# EAGLE design snd (EAGLE 5.11)
DRAWN_BY: Alexios; PROJECT_NAME: CFT Mini-Computer; REVISION: Rev A; SHEET_DESCRIPTION: Audio Device 1 of 2 (Bus Interface & SpeakJet); SIMULATION_FILENAME: N/A; URL: http://www.bedroomlan.org/cft

## Sheet 1 of 4
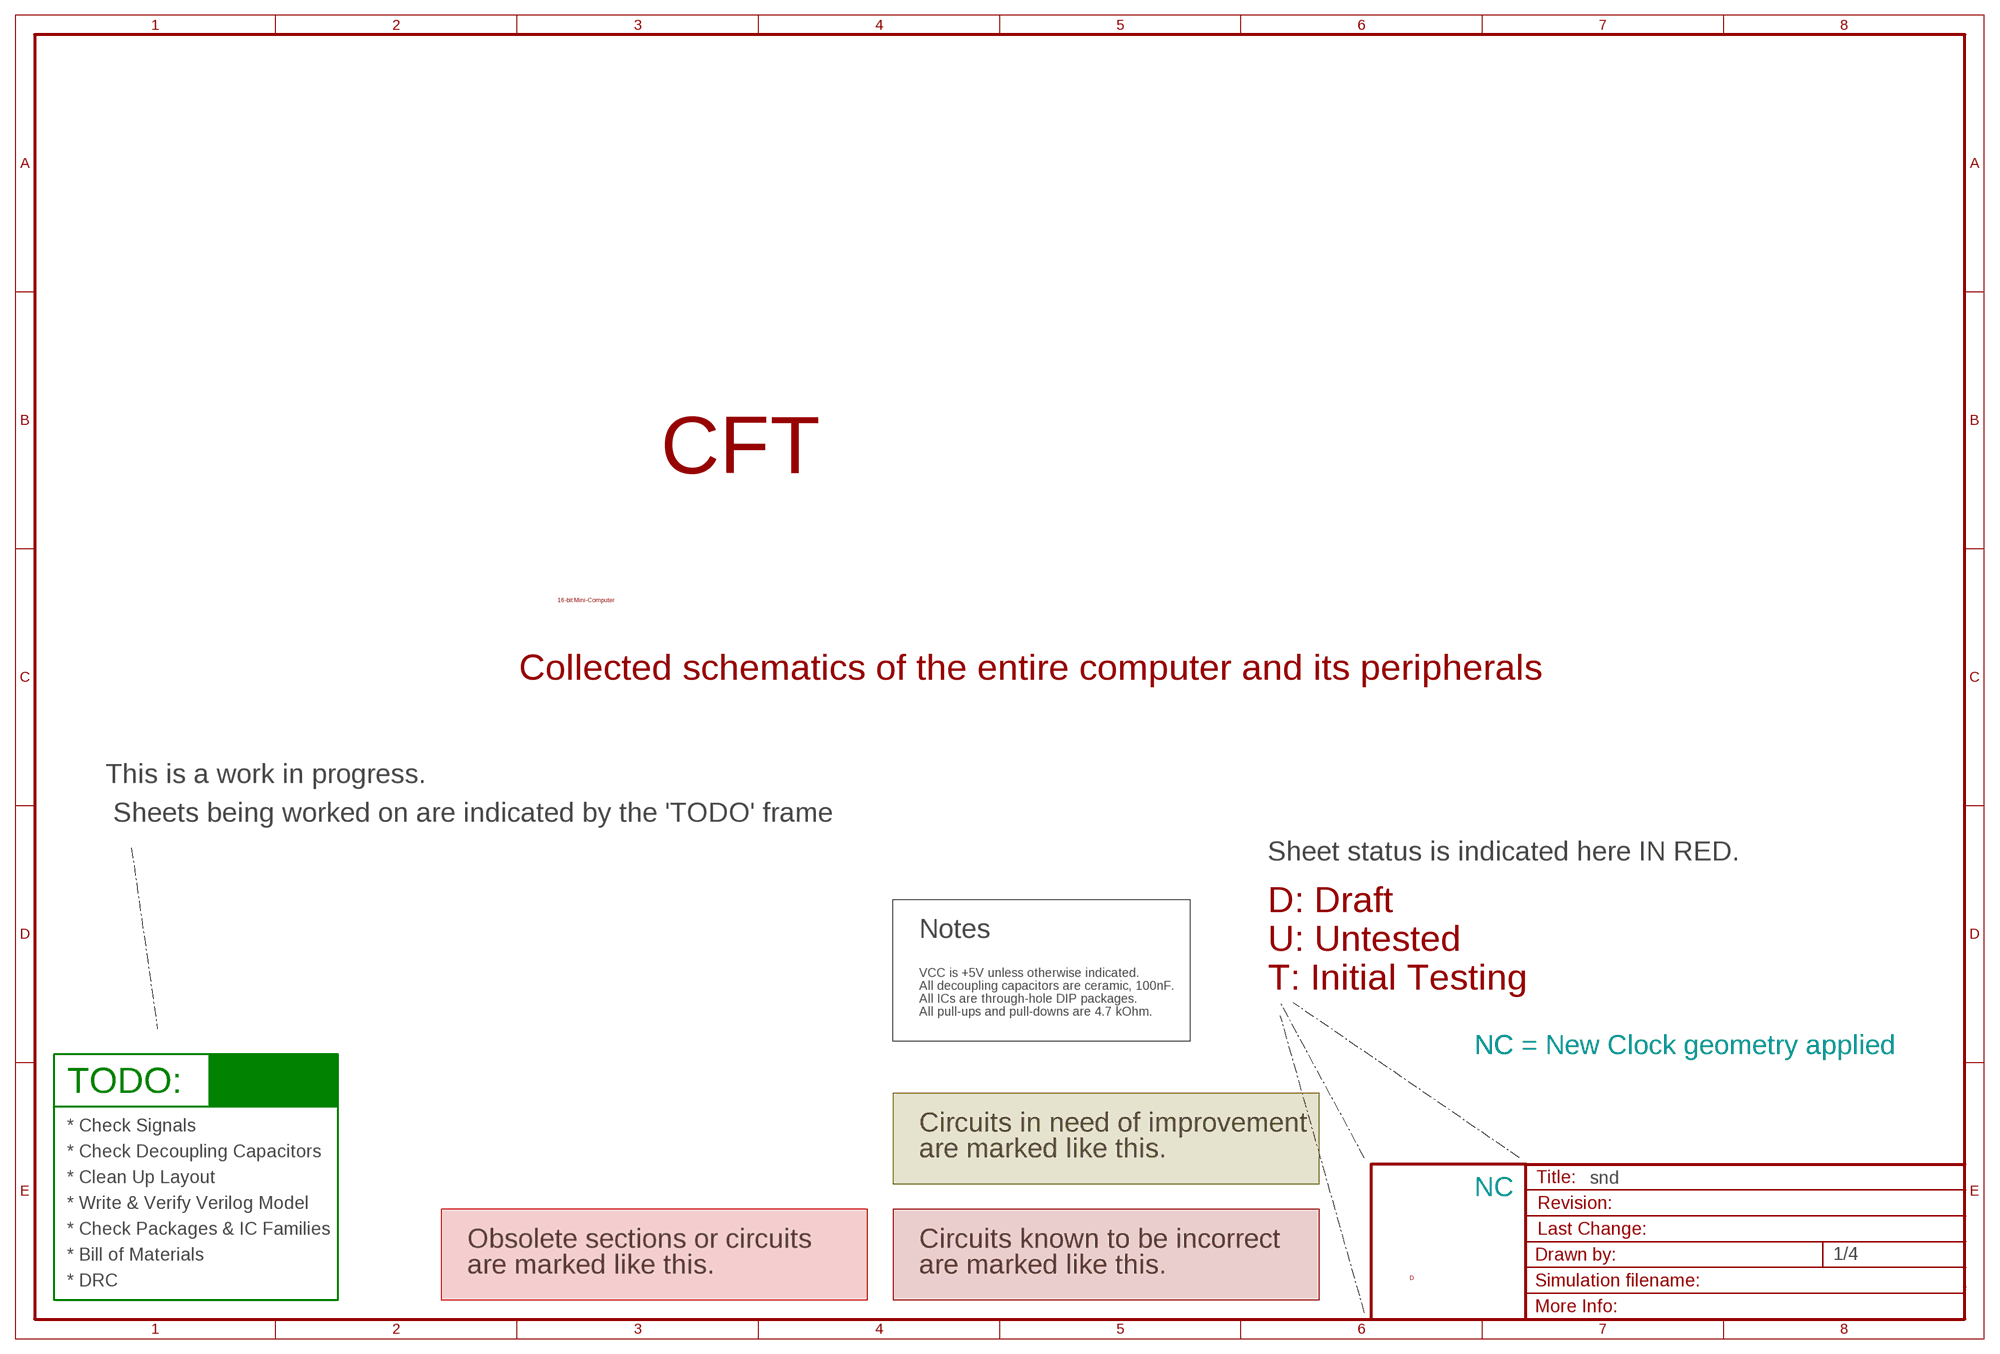
[diagram p0: schematic, sheet 1]

### Notes on the sheet
- CFT
- 16-bit Mini-Computer
- Collected schematics of the entire computer and its peripherals
- This is a work in progress.
- Sheets being worked on are indicated by the 'TODO' frame
- Sheet status is indicated here IN RED.
- D: Draft
- Notes
- U: Untested
- VCC is +5V unless otherwise indicated.
- All decoupling capacitors are ceramic, 100nF. | T: Initial Testing
- All ICs are through-hole DIP packages.
- All pull-ups and pull-downs are 4.7 kOhm.
- NC | NC = New Clock geometry applied
- TODO:
- * Check Signals | Circuits in need of improvement
- * Check Decoupling Capacitors | are marked like this.
- * Clean Up Layout
- NC
- * Write & Verify Verilog Model
- * Check Packages & IC Families
- Obsolete sections or circuits | Circuits known to be incorrect
- * Bill of Materials
- are marked like this. | are marked like this.
- D
- * DRC

## Sheet 2 of 4
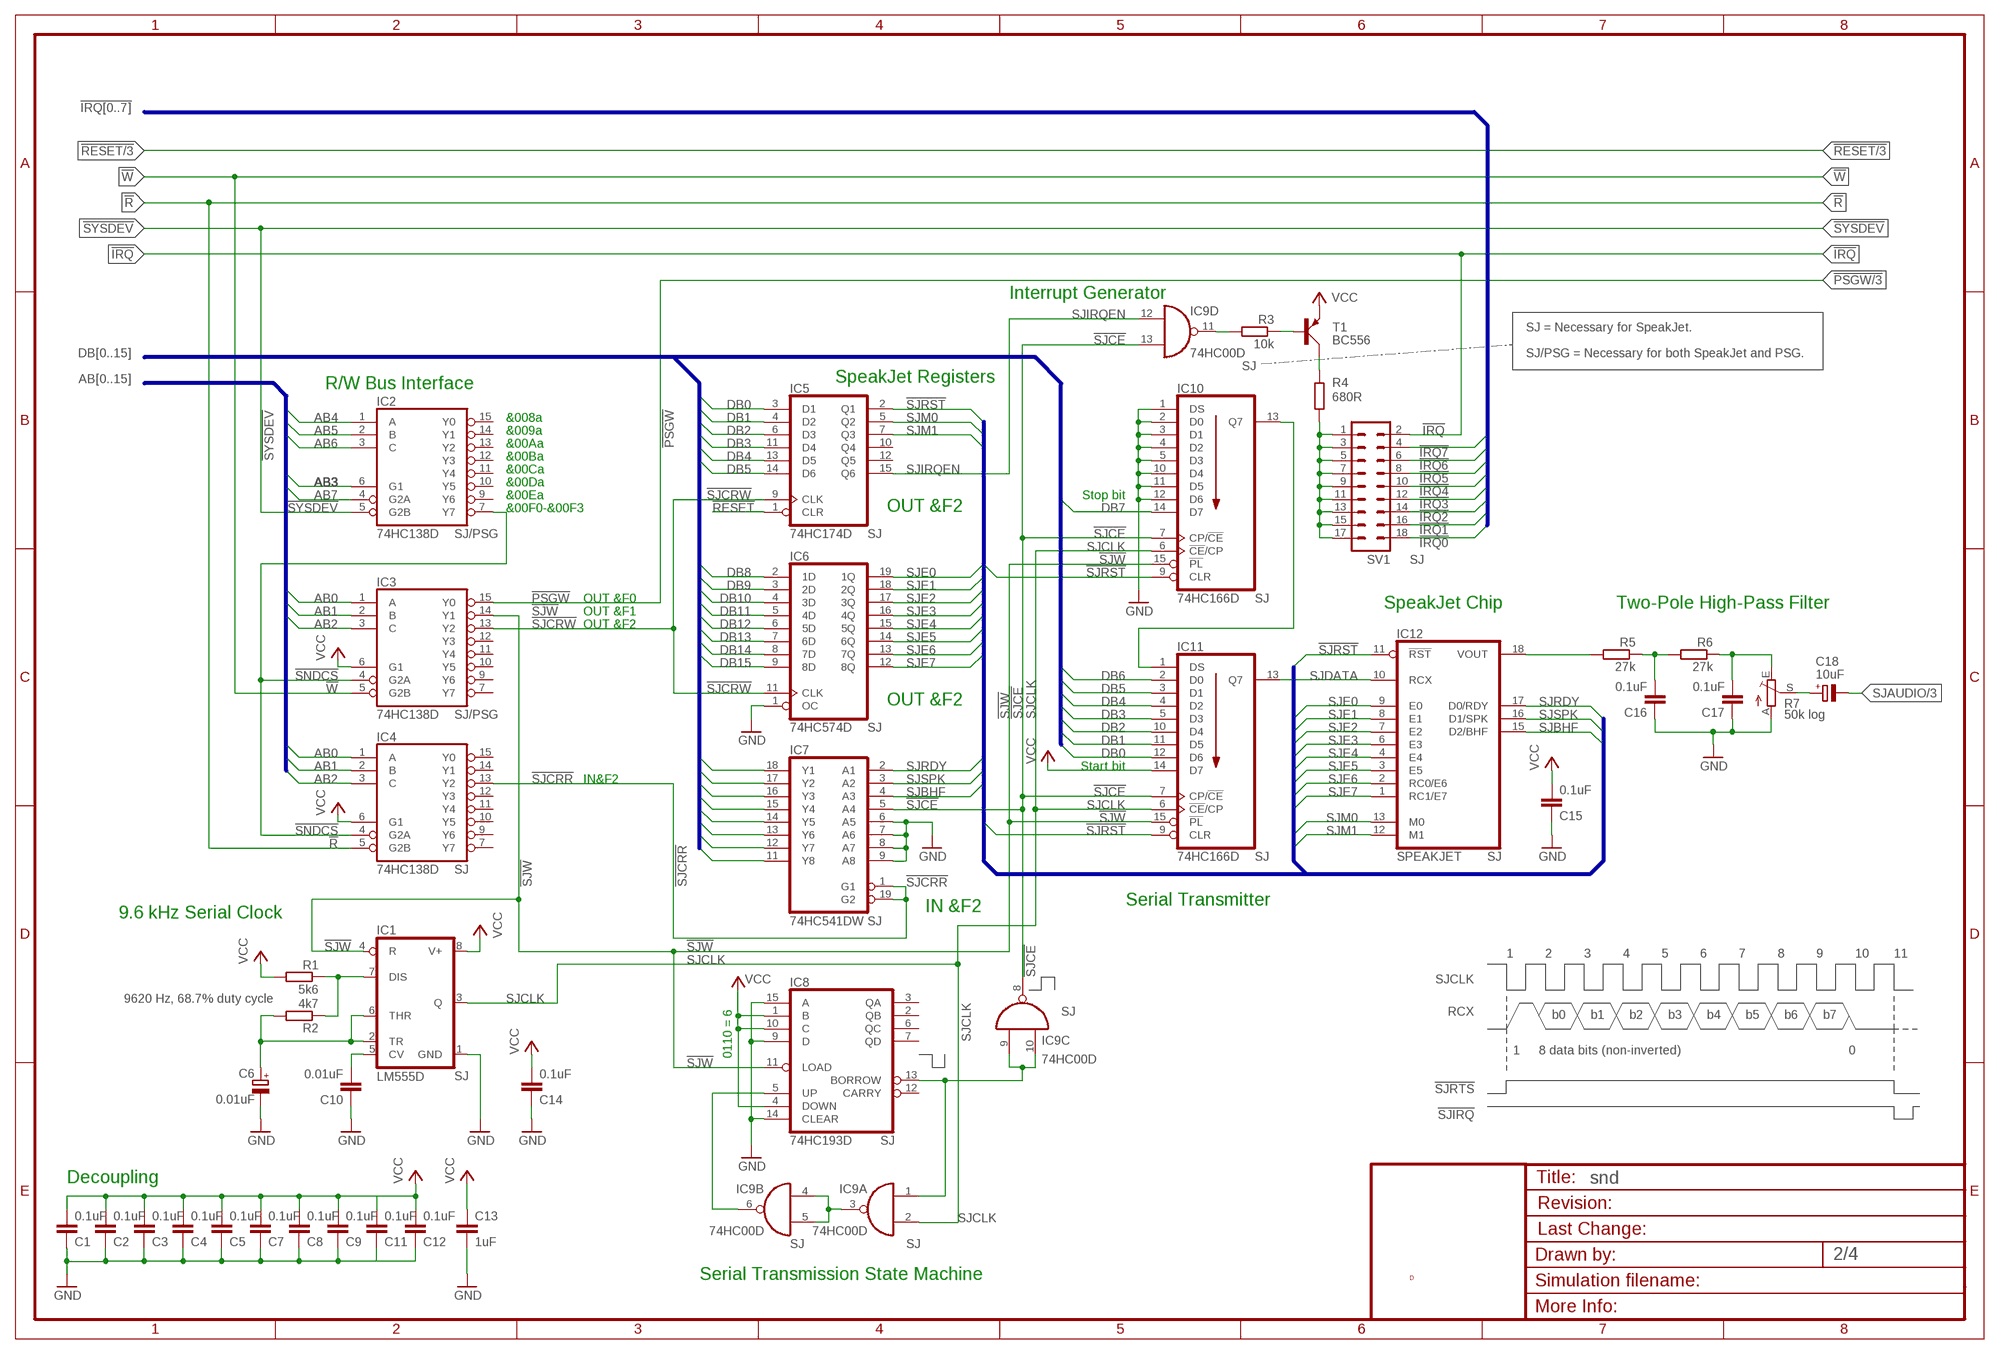
[diagram p1: schematic, sheet 2]

### Parts
C1  0.1uF  C-EUC1206K  [C1206K]
C2  0.1uF  C-EUC1206K  [C1206K]
C3  0.1uF  C-EUC1206K  [C1206K]
C4  0.1uF  C-EUC1206K  [C1206K]
C5  0.1uF  C-EUC1206K  [C1206K]
C6  0.01uF  CPOL-EUE2.5-5  [E2,5-5]
C7  0.1uF  C-EUC1206K  [C1206K]
C8  0.1uF  C-EUC1206K  [C1206K]
C9  0.1uF  C-EUC1206K  [C1206K]
C10  0.01uF  C-EUC1206K  [C1206K]
C11  0.1uF  C-EUC1206K  [C1206K]
C12  0.1uF  C-EUC1206K  [C1206K]
C13  1uF  C-EU025-024X044  [C025-024X044]
C14  0.1uF  C-EUC1206K  [C1206K]
C15  0.1uF  C-EUC1206K  [C1206K]
C16  0.1uF  C-EU025-024X044  [C025-024X044]
C17  0.1uF  C-EU025-024X044  [C025-024X044]
C18  10uF  CPOL-EUE2.5-5  [E2,5-5]
IC1  LM555D  [SO08]
IC2  74HC138D  [SO16]
IC3  74HC138D  [SO16]
IC4  74HC138D  [SO16]
IC5  74HC174D  [SO16]
IC6  74HC574D  [SO20W]
IC7  74HC541DW  [SO20W]
IC8  74HC193D  [SO16D]
IC9  74HC00D  [SO14]
IC10  74HC166D  [SO16]
IC11  74HC166D  [SO16]
IC12  SPEAKJET  [DIL18]
R1  5k6  R-EU_R1206  [R1206]
R2  4k7  R-EU_R1206W  [R1206W]
R3  10k  R-EU_0204/7  [0204/7]
R4  680R  R-EU_0204/7  [0204/7]
R5  27k  R-EU_0204/7  [0204/7]
R6  27k  R-EU_0204/7  [0204/7]
R7  50k log  TRIM_EU-CT6  [CT6]
SV1  MA09-2  [MA09-2]
T1  BC556  BC557  [SOT54A]

### Nets
!INTRN2: R4.2 SV1.1 SV1.3 SV1.5 SV1.7 SV1.9 SV1.11 SV1.13 SV1.15 SV1.17
!IRQ: SV1.2
!IRQ0: SV1.18 ; also sheet 4
!IRQ1: SV1.16 ; also sheet 4
!IRQ2: SV1.14 ; also sheet 4
!IRQ3: SV1.12 ; also sheet 4
!IRQ4: SV1.10 ; also sheet 4
!IRQ5: SV1.8 ; also sheet 4
!IRQ6: SV1.6 ; also sheet 4
!IRQ7: SV1.4 ; also sheet 4
!PSGW: IC3.15(Y0) ; also sheet 3
!R: IC4.5(G2B) ; also sheet 4
!RESET: IC5.1(CLR) ; also sheet 3,4
!SJCE: IC7.5(A4) IC9.8(C:O) IC9.13(D:I1) IC10.7(CP/!CE!) IC11.7(CP/!CE!)
!SJCRR: IC4.13(Y2) IC7.1(G1) IC7.19(G2)
!SJCRW: IC3.13(Y2) IC5.9(CLK) IC6.11(CLK)
!SJRST: IC5.2(Q1) IC10.9(CLR) IC11.9(CLR) IC12.11(!RST)
!SJW: IC1.4(R) IC3.14(Y1) IC8.11(LOAD) IC10.15(!PL) IC11.15(!PL)
!SNDCS: IC2.7(Y7) IC3.4(G2A) IC4.4(G2A)
!SYSDEV: IC2.5(G2B) ; also sheet 4
!W: IC3.5(G2B) ; also sheet 4
AB0: IC3.1(A) IC4.1(A) ; also sheet 4
AB1: IC3.2(B) IC4.2(B) ; also sheet 4
AB2: IC3.3(C) IC4.3(C) ; also sheet 4
AB3: IC2.6(G1) ; also sheet 4
AB4: IC2.1(A) ; also sheet 4
AB5: IC2.2(B) ; also sheet 4
AB6: IC2.3(C) ; also sheet 4
AB7: IC2.4(G2A) ; also sheet 4
DB0: IC5.3(D1) IC7.18(Y1) IC11.12(D6) ; also sheet 3,4
DB1: IC5.4(D2) IC7.17(Y2) IC11.11(D5) ; also sheet 3,4
DB2: IC5.6(D3) IC7.16(Y3) IC11.10(D4) ; also sheet 3,4
DB3: IC5.11(D4) IC7.15(Y4) IC11.5(D3) ; also sheet 3,4
DB4: IC5.13(D5) IC7.14(Y5) IC11.4(D2) ; also sheet 3,4
DB5: IC5.14(D6) IC7.13(Y6) IC11.3(D1) ; also sheet 3,4
DB6: IC7.12(Y7) IC11.2(D0) ; also sheet 3,4
DB7: IC7.11(Y8) IC10.14(D7) ; also sheet 3,4
DB8: IC6.2(1D) ; also sheet 3,4
DB9: IC6.3(2D) ; also sheet 4
DB10: IC6.4(3D) ; also sheet 4
DB11: IC6.5(4D) ; also sheet 4
DB12: IC6.6(5D) ; also sheet 4
DB13: IC6.7(6D) ; also sheet 4
DB14: IC6.8(7D) ; also sheet 4
DB15: IC6.9(8D) ; also sheet 4
GND [low power]: C6.- C10.1 C11.1 C12.1 C13.2 C14.1 C15.1 C16.1 C17.1 IC1.1(GND) IC6.1(OC) IC7.6(A5) IC7.7(A6) IC7.8(A7) IC7.9(A8) IC8.9(D) IC8.14(CLEAR) IC8.15(A) IC10.1(DS) IC10.2(D0) IC10.3(D1) IC10.4(D2) IC10.5(D3) IC10.10(D4) IC10.11(D5) IC10.12(D6) R7.A ; also sheet 3,4
N$87: IC10.13(Q7) IC11.1(DS)
N$387: IC9.11(D:O) R3.2
N$388: R3.1 T1.B
N$419: R4.1 T1.C
N$423: C10.2 IC1.5(CV)
N$424: C6.+ IC1.2(TR) IC1.6(THR) R2.2
N$425: IC12.18(VOUT) R5.2
N$442: IC1.7(DIS) R1.1 R2.1
N$443: IC8.5(UP) IC9.6(B:O)
N$444: C16.2 R5.1 R6.2
N$445: IC8.13(BORROW) IC9.1(A:I0) IC9.9(C:I0) IC9.10(C:I1)
N$446: IC9.3(A:O) IC9.4(B:I0) IC9.5(B:I1)
N$447: C17.2 R6.1 R7.E
N$448: C18.+ R7.S
SJAUDIO: C18.- ; also sheet 3
SJBHF: IC7.4(A3) IC12.15(D2/BHF)
SJCLK: IC1.3(Q) IC9.2(A:I1) IC10.6(!CE!/CP) IC11.6(!CE!/CP)
SJDATA: IC11.13(Q7) IC12.10(RCX)
SJE0: IC6.19(1Q) IC12.9(E0)
SJE1: IC6.18(2Q) IC12.8(E1)
SJE2: IC6.17(3Q) IC12.7(E2)
SJE3: IC6.16(4Q) IC12.6(E3)
SJE4: IC6.15(5Q) IC12.4(E4)
SJE5: IC6.14(6Q) IC12.3(E5)
SJE6: IC6.13(7Q) IC12.2(RC0/E6)
SJE7: IC6.12(8Q) IC12.1(RC1/E7)
SJIRQEN: IC5.15(Q6) IC9.12(D:I0)
SJM0: IC5.5(Q2) IC12.13(M0)
SJM1: IC5.7(Q3) IC12.12(M1)
SJRDY: IC7.2(A1) IC12.17(D0/RDY)
SJSPK: IC7.3(A2) IC12.16(D1/SPK)
VCC [low power]: C11.2 C12.2 C13.1 C14.2 C15.2 IC1.8(V+) IC3.6(G1) IC4.6(G1) IC8.1(B) IC8.4(DOWN) IC8.10(C) IC11.14(D7) R1.2 T1.E ; also sheet 3,4
Unconnected: C1.1 C1.2 C2.1 C2.2 C3.1 C3.2 C4.1 C4.2 C5.1 C5.2 C7.1 C7.2 C8.1 C8.2 C9.1 C9.2 IC2.9(Y6) IC2.10(Y5) IC2.11(Y4) IC2.12(Y3) IC2.13(Y2) IC2.14(Y1) IC2.15(Y0) IC3.7(Y7) IC3.9(Y6) IC3.10(Y5) IC3.11(Y4) IC3.12(Y3) IC4.7(Y7) IC4.9(Y6) IC4.10(Y5) IC4.11(Y4) IC4.12(Y3) IC4.14(Y1) IC4.15(Y0) IC5.10(Q4) IC5.12(Q5) IC8.2(QB) IC8.3(QA) IC8.6(QC) IC8.7(QD) IC8.12(CARRY)

### Buses
DB[0..15]
AB[0..15]
SJE[0..7],SJM[0..1],!SJRST,SJRDY,SJSPK,SJBHF
!IRQ[0..7]

### Notes on the sheet
- Interrupt Generator
- SJ = Necessary for SpeakJet.
- SJ/PSG = Necessary for both SpeakJet and PSG.
- SJ
- SpeakJet Registers
- R/W Bus Interface
- &008a
- &009a
- &00Aa
- &00Ba
- &00Ca
- &00Da
- &00Ea | Stop bit
- &00F0-&00F3 | OUT &F2
- SJ/PSG | SJ
- SJ
- OUT &F0 | SJ
- SpeakJet Chip | Two-Pole High-Pass Filter
- OUT &F1
- OUT &F2
- OUT &F2
- SJ/PSG
- SJ
- Start bit
- IN&F2
- SJ | SJ
- SJ
- Serial Transmitter
- IN &F2
- 9.6 kHz Serial Clock
- SJ
- 1 | 2 | 3 | 4 | 5 | 6 | 7 | 8 | 9 | 10 | 11
- SJCLK
- 9620 Hz, 68.7% duty cycle
- 0110 = 6
- SJ | RCX | b0 | b1 | b2 | b3 | b4 | b5 | b6 | b7
- 1 | 8 data bits (non-inverted) | 0
- SJ
- !SJRTS
- !SJIRQ
- SJ
- Decoupling
- SJ | SJ
- Serial Transmission State Machine | D

## Sheet 3 of 4
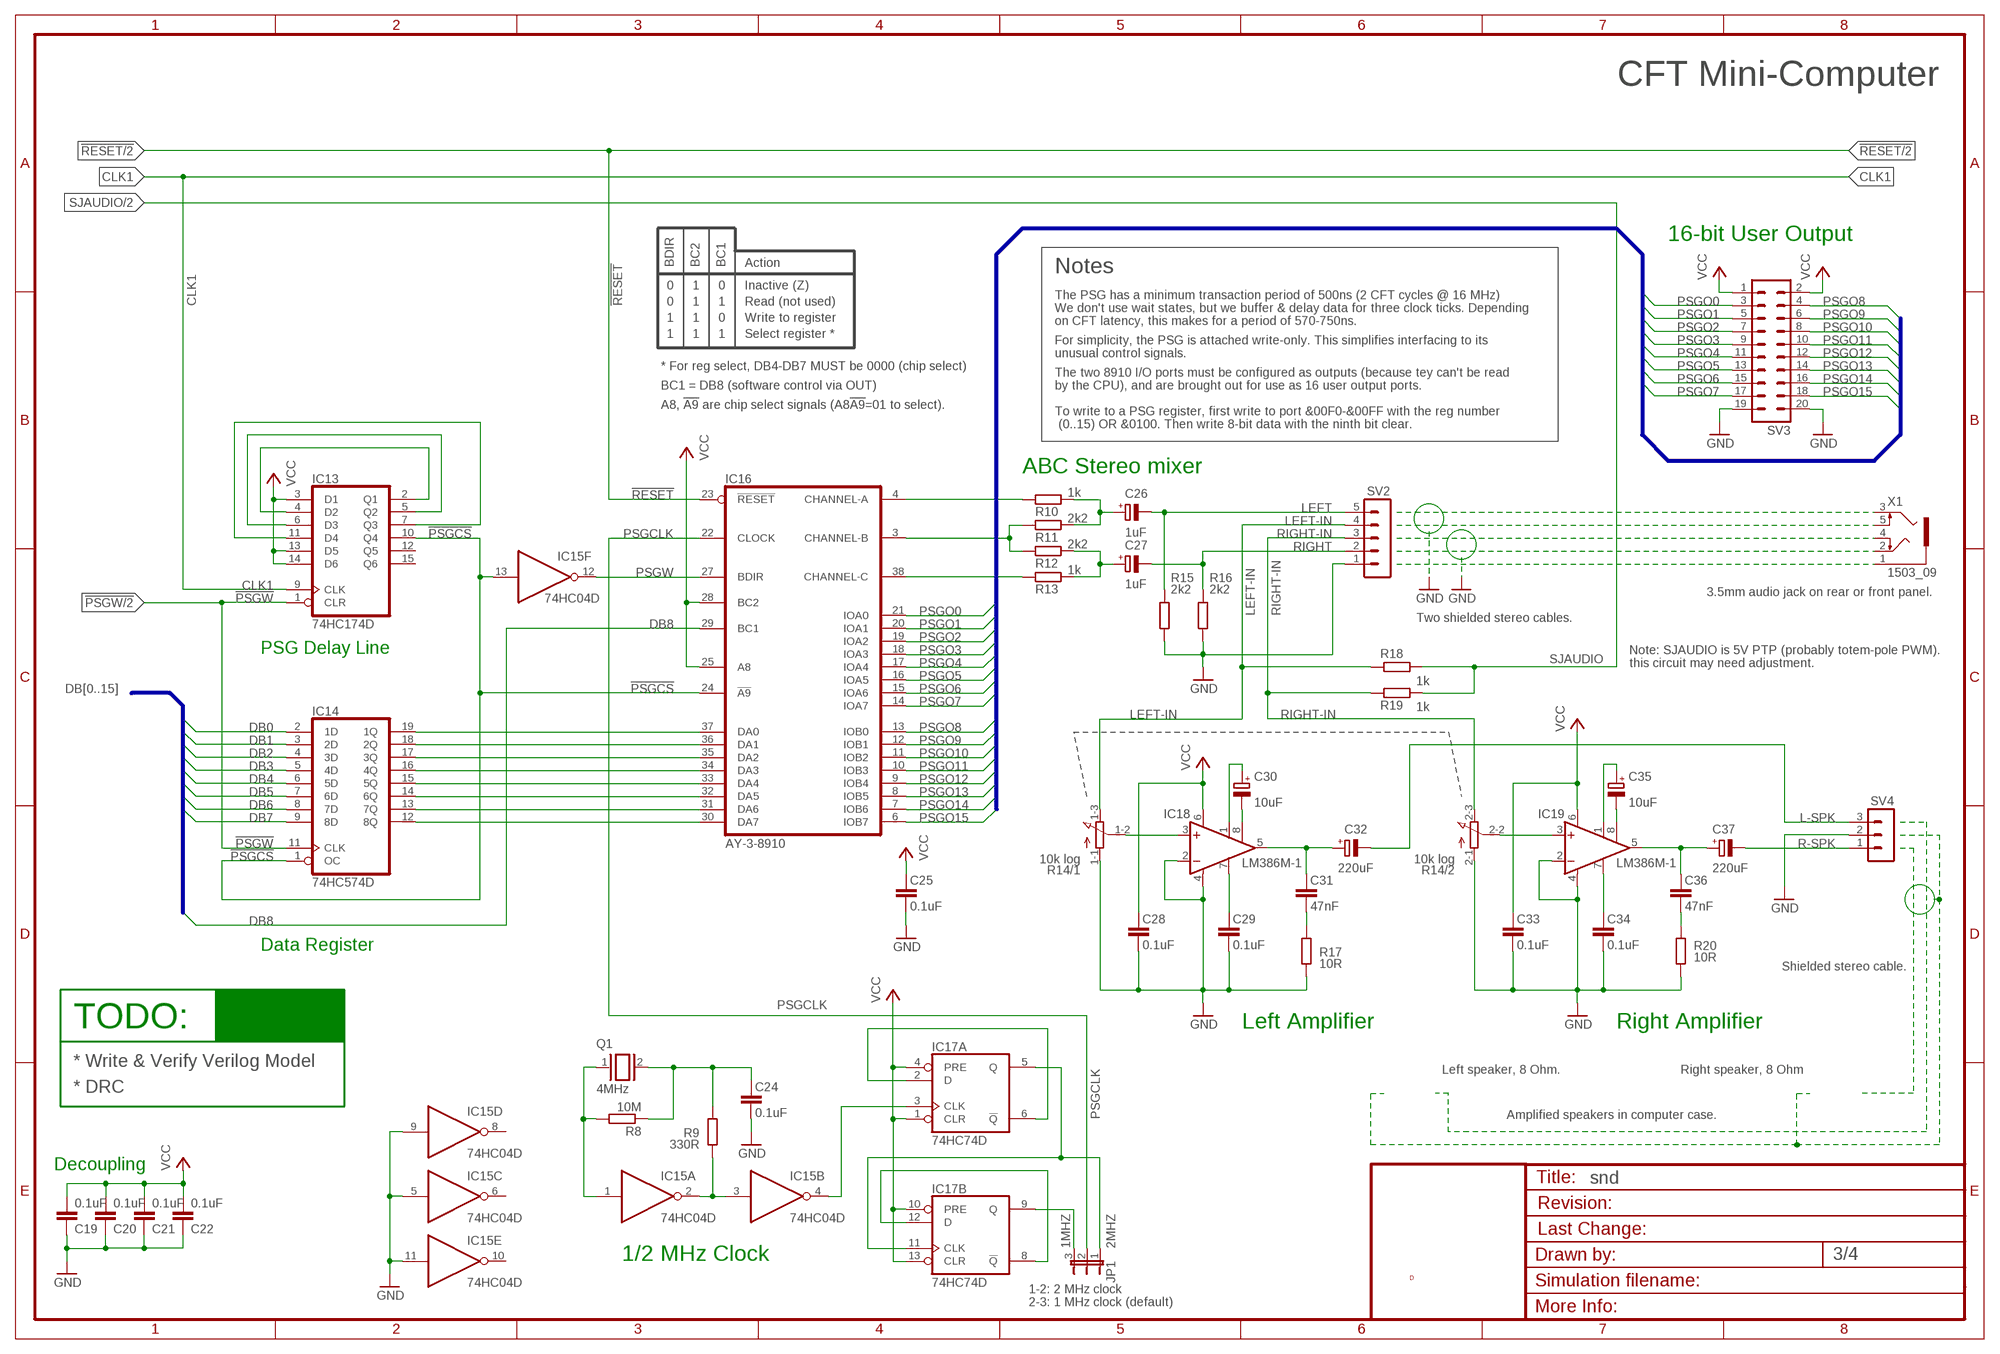
[diagram p2: schematic, sheet 3]

### Parts
C19  0.1uF  C-EUC1206K  [C1206K]
C20  0.1uF  C-EUC1206K  [C1206K]
C21  0.1uF  C-EUC1206K  [C1206K]
C22  0.1uF  C-EUC1206K  [C1206K]
C24  0.1uF  C-EUC1206K  [C1206K]
C25  0.1uF  C-EUC1206K  [C1206K]
C26  1uF  CPOL-EUSMCD  [SMC_D]
C27  1uF  CPOL-EUE2.5-5  [E2,5-5]
C28  0.1uF  C-EU025-024X044  [C025-024X044]
C29  0.1uF  C-EU025-024X044  [C025-024X044]
C30  10uF  CPOL-EUE2.5-5  [E2,5-5]
C31  47nF  C-EU025-024X044  [C025-024X044]
C32  220uF  CPOL-EUE2.5-5  [E2,5-5]
C33  0.1uF  C-EU025-024X044  [C025-024X044]
C34  0.1uF  C-EU025-024X044  [C025-024X044]
C35  10uF  CPOL-EUE2.5-5  [E2,5-5]
C36  47nF  C-EU025-024X044  [C025-024X044]
C37  220uF  CPOL-EUE2.5-5  [E2,5-5]
IC13  74HC174D  [SO16]
IC14  74HC574D  [SO20W]
IC15  74HC04D  [SO14]
IC16  AY-3-8910  [DIL40]
IC17  74HC74D  [SO14]
IC18  LM386M-1  [SO08]
IC19  LM386M-1  [SO08]
JP1  JP2E  [JP2]
Q1  4MHz  XTAL/S  [QS]
R8  10M  R-EU_R1206W  [R1206W]
R9  330R  R-EU_R1206W  [R1206W]
R10  1k  R-EU_0204/7  [0204/7]
R11  2k2  R-EU_0204/7  [0204/7]
R12  2k2  R-EU_0204/7  [0204/7]
R13  1k  R-EU_0204/7  [0204/7]
R14  10k log  3RP/1610G  [3RP/1610G]
R15  2k2  R-EU_0204/7  [0204/7]
R16  2k2  R-EU_0204/7  [0204/7]
R17  10R  R-EU_0204/7  [0204/7]
R18  1k  R-EU_0204/7  [0204/7]
R19  1k  R-EU_0204/7  [0204/7]
R20  10R  R-EU_0204/7  [0204/7]
SV2  MA05-1  [MA05-1]
SV3  MA10-2  [MA10-2]
SV4  MA03-1  [MA03-1]
X1  1503_09  [1503_09]

### Nets
1MHZ: IC17.9(B:Q) JP1.3
2MHZ: IC17.5(A:Q) IC17.11(B:CLK) JP1.1
!PSGCS: IC13.10(Q4) IC14.1(OC) IC15.13(F:I) IC16.24(!A9)
!PSGW: IC13.1(CLR) IC14.11(CLK) ; also sheet 2
!RESET: IC16.23(!RESET) ; also sheet 2,4
CLK1: IC13.9(CLK) ; also sheet 4
DB0: IC14.2(1D) ; also sheet 2,4
DB1: IC14.3(2D) ; also sheet 2,4
DB2: IC14.4(3D) ; also sheet 2,4
DB3: IC14.5(4D) ; also sheet 2,4
DB4: IC14.6(5D) ; also sheet 2,4
DB5: IC14.7(6D) ; also sheet 2,4
DB6: IC14.8(7D) ; also sheet 2,4
DB7: IC14.9(8D) ; also sheet 2,4
DB8: IC16.29(BC1) ; also sheet 2,4
GND [low power]: C19.1 C20.1 C21.1 C22.1 C24.1 C25.1 C28.1 C29.1 C33.1 C34.1 IC15.5(C:I) IC15.9(D:I) IC15.11(E:I) IC18.2(-IN) IC18.4(GND) IC19.2(-IN) IC19.4(GND) R14.1-1(/1:A) R14.2-1(/2:A) R15.2 R16.2 R17.2 R20.2 SV2.1 SV3.19 SV3.20 SV4.2 X1.1 ; also sheet 2,4
L-SPK: C32.- SV4.3
LEFT: C26.- R15.1 SV2.5 X1.3
LEFT-IN: R14.1-3(/1:E) R18.2 SV2.4 X1.5
N$29: IC16.4(CHANNEL-A) R10.2
N$30: IC16.3(CHANNEL-B) R11.2 R12.2
N$35: C26.+ R10.1 R11.1
N$37: IC16.38(CHANNEL-C) R13.2
N$46: C27.+ R12.1 R13.1
N$47: C34.2 IC19.7(BYPASS)
N$48: C36.1 R20.1
N$49: C30.- IC18.8(GAIN)
N$50: C30.+ IC18.1(GAIN)
N$80: C29.2 IC18.7(BYPASS)
N$81: IC14.12(8Q) IC16.30(DA7)
N$84: IC14.13(7Q) IC16.31(DA6)
N$85: C31.1 R17.1
N$86: C31.2 C32.+ IC18.5(OUT)
N$88: IC18.3(+IN) R14.1-2(/1:S)
N$92: C36.2 C37.+ IC19.5(OUT)
N$146: IC19.3(+IN) R14.2-2(/2:S)
N$148: C35.- IC19.8(GAIN)
N$149: C35.+ IC19.1(GAIN)
N$361: IC15.1(A:I) Q1.1 R8.2
N$362: IC15.2(A:O) IC15.3(B:I) R9.2
N$363: C24.2 Q1.2 R8.1 R9.1
N$364: IC15.4(B:O) IC17.3(A:CLK)
N$365: IC14.14(6Q) IC16.32(DA5)
N$367: IC17.2(A:D) IC17.6(A:!Q)
N$368: IC17.8(B:!Q) IC17.12(B:D)
N$374: IC14.15(5Q) IC16.33(DA4)
N$380: IC14.16(4Q) IC16.34(DA3)
N$383: IC14.17(3Q) IC16.35(DA2)
N$384: IC14.18(2Q) IC16.36(DA1)
N$386: IC14.19(1Q) IC16.37(DA0)
N$420: IC13.2(Q1) IC13.4(D2)
N$421: IC13.5(Q2) IC13.6(D3)
N$422: IC13.7(Q3) IC13.11(D4)
PSGCLK: IC16.22(CLOCK) JP1.2
PSGO0: IC16.21(IOA0) SV3.3
PSGO1: IC16.20(IOA1) SV3.5
PSGO2: IC16.19(IOA2) SV3.7
PSGO3: IC16.18(IOA3) SV3.9
PSGO4: IC16.17(IOA4) SV3.11
PSGO5: IC16.16(IOA5) SV3.13
PSGO6: IC16.15(IOA6) SV3.15
PSGO7: IC16.14(IOA7) SV3.17
PSGO8: IC16.13(IOB0) SV3.4
PSGO9: IC16.12(IOB1) SV3.6
PSGO10: IC16.11(IOB2) SV3.8
PSGO11: IC16.10(IOB3) SV3.10
PSGO12: IC16.9(IOB4) SV3.12
PSGO13: IC16.8(IOB5) SV3.14
PSGO14: IC16.7(IOB6) SV3.16
PSGO15: IC16.6(IOB7) SV3.18
PSGW: IC15.12(F:O) IC16.27(BDIR)
R-SPK: C37.- SV4.1
RIGHT: C27.- R16.1 SV2.2 X1.2
RIGHT-IN: R14.2-3(/2:E) R19.2 SV2.3 X1.4
SJAUDIO: R18.1 R19.1 ; also sheet 2
VCC [low power]: C19.2 C20.2 C21.2 C22.2 C25.2 C28.2 C33.2 IC13.3(D1) IC13.13(D5) IC13.14(D6) IC16.25(A8) IC16.28(BC2) IC17.1(A:CLR) IC17.4(A:PRE) IC17.10(B:PRE) IC17.13(B:CLR) IC18.6(VS) IC19.6(VS) SV3.1 SV3.2 ; also sheet 2,4
Unconnected: IC13.12(Q5) IC13.15(Q6) IC15.6(C:O) IC15.8(D:O) IC15.10(E:O)

### Buses
DB[0..15]
PSGO[0..15]

### Notes on the sheet
- CFT Mini-Computer
- 16-bit User Output
- BDIR | BC2 | BC1 | Action
- Notes
- 0 | 1 | 0 | Inactive (Z)
- The PSG has a minimum transaction period of 500ns (2 CFT cycles @ 16 MHz)
- 0 | 1 | 1 | Read (not used)
- We don't use wait states, but we buffer & delay data for three clock ticks. Depending
- 1 | 1 | 0 | Write to register | on CFT latency, this makes for a period of 570-750ns.
- 1 | 1 | 1 | Select register *
- For simplicity, the PSG is attached write-only. This simplifies interfacing to its
- unusual control signals.
- * For reg select, DB4-DB7 MUST be 0000 (chip select)
- The two 8910 I/O ports must be configured as outputs (because tey can't be read
- BC1 = DB8 (software control via OUT) | by the CPU), and are brought out for use as 16 user output ports.
- A8, !A9! are chip select signals (A8!A9!=01 to select).
- To write to a PSG register, first write to port &00F0-&00FF with the reg number
- (0..15) OR &0100. Then write 8-bit data with the ninth bit clear.
- ABC Stereo mixer
- 3.5mm audio jack on rear or front panel.
- Two shielded stereo cables.
- PSG Delay Line | Note: SJAUDIO is 5V PTP (probably totem-pole PWM).
- this circuit may need adjustment.
- Data Register
- Shielded stereo cable.
- TODO: | Left Amplifier | Right Amplifier
- * Write & Verify Verilog Model
- Left speaker, 8 Ohm. | Right speaker, 8 Ohm
- * DRC
- Amplified speakers in computer case.
- Decoupling
- 1/2 MHz Clock
- D
- 1-2: 2 MHz clock
- 2-3: 1 MHz clock (default)

## Sheet 4 of 4
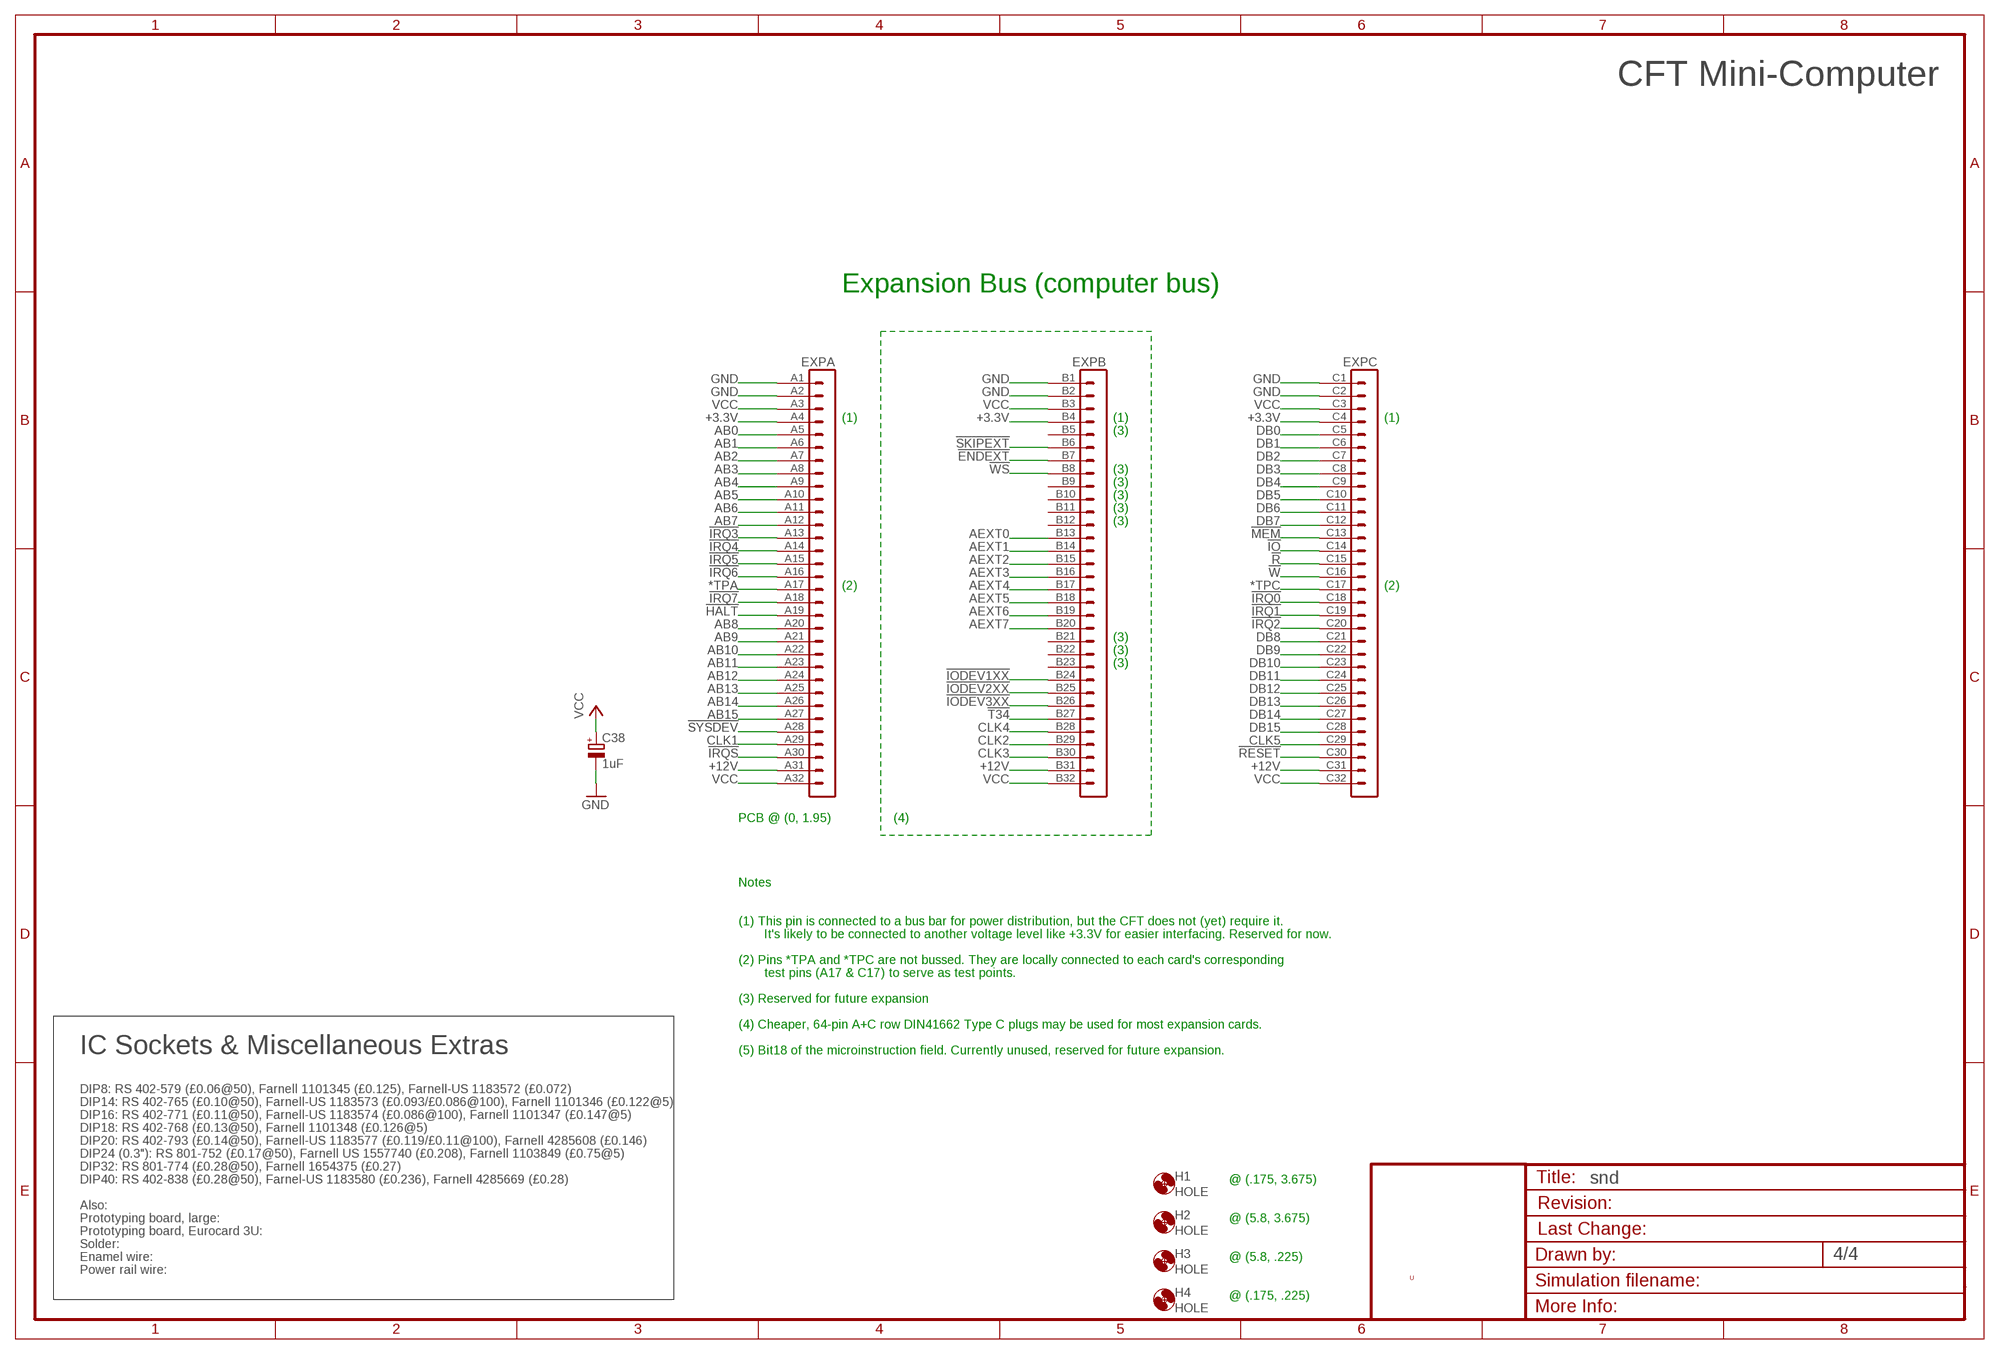
[diagram p3: schematic, sheet 4]

### Parts
C38  1uF  CPOL-EUE2.5-5  [E2,5-5]
EXP  VG96-3K  [VG96K]
H1  HOLE  [STANDOFF_28_60]
H2  HOLE  [STANDOFF_28_60]
H3  HOLE  [STANDOFF_28_60]
H4  HOLE  [STANDOFF_28_60]

### Nets
!ENDEXT: EXP.B7
!HALT: EXP.A19
!IO: EXP.C14
!IODEV1XX: EXP.B24
!IODEV2XX: EXP.B25
!IODEV3XX: EXP.B26
!IRQ0: EXP.C18 ; also sheet 2
!IRQ1: EXP.C19 ; also sheet 2
!IRQ2: EXP.C20 ; also sheet 2
!IRQ3: EXP.A13 ; also sheet 2
!IRQ4: EXP.A14 ; also sheet 2
!IRQ5: EXP.A15 ; also sheet 2
!IRQ6: EXP.A16 ; also sheet 2
!IRQ7: EXP.A18 ; also sheet 2
!IRQS: EXP.A30
!MEM: EXP.C13
!R: EXP.C15 ; also sheet 2
!RESET: EXP.C30 ; also sheet 2,3
!SKIPEXT: EXP.B6
!SYSDEV: EXP.A28 ; also sheet 2
!T34: EXP.B27
!W: EXP.C16 ; also sheet 2
!WS: EXP.B8
*TPA: EXP.A17
*TPC: EXP.C17
+3.3V: EXP.A4 EXP.B4 EXP.C4
+12V [LED power]: EXP.A31 EXP.B31 EXP.C31
AB0: EXP.A5 ; also sheet 2
AB1: EXP.A6 ; also sheet 2
AB2: EXP.A7 ; also sheet 2
AB3: EXP.A8 ; also sheet 2
AB4: EXP.A9 ; also sheet 2
AB5: EXP.A10 ; also sheet 2
AB6: EXP.A11 ; also sheet 2
AB7: EXP.A12 ; also sheet 2
AB8: EXP.A20
AB9: EXP.A21
AB10: EXP.A22
AB11: EXP.A23
AB12: EXP.A24
AB13: EXP.A25
AB14: EXP.A26
AB15: EXP.A27
AEXT0: EXP.B13
AEXT1: EXP.B14
AEXT2: EXP.B15
AEXT3: EXP.B16
AEXT4: EXP.B17
AEXT5: EXP.B18
AEXT6: EXP.B19
AEXT7: EXP.B20
CLK1: EXP.A29 ; also sheet 3
CLK2: EXP.B29
CLK3: EXP.B30
CLK4: EXP.B28
CLK5: EXP.C29
DB0: EXP.C5 ; also sheet 2,3
DB1: EXP.C6 ; also sheet 2,3
DB2: EXP.C7 ; also sheet 2,3
DB3: EXP.C8 ; also sheet 2,3
DB4: EXP.C9 ; also sheet 2,3
DB5: EXP.C10 ; also sheet 2,3
DB6: EXP.C11 ; also sheet 2,3
DB7: EXP.C12 ; also sheet 2,3
DB8: EXP.C21 ; also sheet 2,3
DB9: EXP.C22 ; also sheet 2
DB10: EXP.C23 ; also sheet 2
DB11: EXP.C24 ; also sheet 2
DB12: EXP.C25 ; also sheet 2
DB13: EXP.C26 ; also sheet 2
DB14: EXP.C27 ; also sheet 2
DB15: EXP.C28 ; also sheet 2
GND [low power]: C38.- EXP.A1 EXP.A2 EXP.B1 EXP.B2 EXP.C1 EXP.C2 ; also sheet 2,3
VCC [low power]: C38.+ EXP.A3 EXP.A32 EXP.B3 EXP.B32 EXP.C3 EXP.C32 ; also sheet 2,3
Unconnected: EXP.B5 EXP.B9 EXP.B10 EXP.B11 EXP.B12 EXP.B21 EXP.B22 EXP.B23

### Notes on the sheet
- CFT Mini-Computer
- Expansion Bus (computer bus)
- (1) | (1) | (1)
- (3)
- (3)
- (3)
- (3)
- (3)
- (3)
- (2) | (2)
- (3)
- (3)
- (3)
- PCB @ (0, 1.95) | (4)
- Notes
- (1) This pin is connected to a bus bar for power distribution, but the CFT does not (yet) require it.
- It's likely to be connected to another voltage level like +3.3V for easier interfacing. Reserved for now.
- (2) Pins *TPA and *TPC are not bussed. They are locally connected to each card's corresponding
- test pins (A17 & C17) to serve as test points.
- (3) Reserved for future expansion
- (4) Cheaper, 64-pin A+C row DIN41662 Type C plugs may be used for most expansion cards.
- IC Sockets & Miscellaneous Extras | (5) Bit18 of the microinstruction field. Currently unused, reserved for future expansion.
- DIP8: RS 402-579 (£0.06@50), Farnell 1101345 (£0.125), Farnell-US 1183572 (£0.072)
- DIP14: RS 402-765 (£0.10@50), Farnell-US 1183573 (£0.093/£0.086@100), Farnell 1101346 (£0.122@5)
- DIP16: RS 402-771 (£0.11@50), Farnell-US 1183574 (£0.086@100), Farnell 1101347 (£0.147@5)
- DIP18: RS 402-768 (£0.13@50), Farnell 1101348 (£0.126@5)
- DIP20: RS 402-793 (£0.14@50), Farnell-US 1183577 (£0.119/£0.11@100), Farnell 4285608 (£0.146)
- DIP24 (0.3"): RS 801-752 (£0.17@50), Farnell US 1557740 (£0.208), Farnell 1103849 (£0.75@5)
- DIP32: RS 801-774 (£0.28@50), Farnell 1654375 (£0.27)
- DIP40: RS 402-838 (£0.28@50), Farnel-US 1183580 (£0.236), Farnell 4285669 (£0.28) | @ (.175, 3.675)
- Also:
- Prototyping board, large: | @ (5.8, 3.675)
- Prototyping board, Eurocard 3U:
- Solder:
- Enamel wire: | @ (5.8, .225)
- Power rail wire:
- U
- @ (.175, .225)

## Power pins joined to a net without a drawn wire
GND: IC2.8(GND) IC3.8(GND) IC4.8(GND) IC5.8(GND) IC6.10(GND) IC7.10(GND) IC8.8(GND) IC9.7(P:GND) IC10.8(GND) IC11.8(GND) IC12.5(GND) IC13.8(GND) IC14.10(GND) IC15.7(P:GND) IC16.1(GND) IC17.7(P:GND)
VCC: IC2.16(VCC) IC3.16(VCC) IC4.16(VCC) IC5.16(VCC) IC6.20(VCC) IC7.20(VCC) IC8.16(VCC) IC9.14(P:VCC) IC10.16(VCC) IC11.16(VCC) IC12.14(VCC) IC13.16(VCC) IC14.20(VCC) IC15.14(P:VCC) IC16.40(VCC) IC17.14(P:VCC)

## Library data of the parts
C1-C5 C7-C17 C19-C22 C24 C25 C28 C29 C31 C33 C34 C36 = rcl:C-EU: CAPACITOR, European symbol
C6 C18 C26 C27 C30 C32 C35 C37 C38 = rcl:CPOL-EU: POLARIZED CAPACITOR, European symbol
EXP = alexios-19inch:VG96-3: PCB EUROCARD, 96-pin type C/ABC, 2.54 mm
H1-H4 = alexios:HOLE: Hole for a standoff or mount. Hole diameter: 3.3mm. External Diameter: 6mm.
IC1 = alexios:*555: TIMER
IC2-IC4 = 74xx-eu:74*138: 3-line to 8-line DECODER/DEMULTIPLEXER
IC5 IC13 = alexios:74*174: Hex D type FLIP FLOP, clear
IC6 IC14 = alexios:74*574: 8-bit D type FLIP FLOP bus driver
IC7 = alexios:74*541: Octal BUFFER and LINE DRIVER, 3-state
IC8 = alexios:74*193: Presettable Synchronous Binary Up/Down Counter Up/down 4-bit binary counter with load and clear inputs, and borrow and carry outputs. Farnell description: <http://uk.farnell.com/nxp/74hct193n/ic-74hct-cmos-74hct193-dip16-5v/dp/382218> Order Code: 382218 Manufacturer Part No: 74HCT193N RoHS : Yes Description: IC, 74HCT CMOS, 74HCT193, DIP16, 5V Counter Type:Binary Clock Frequency:47MHz Count Maximum:15 Supply Voltage Range:4.5V to 5.5V Logic Case Style:DIP No. of Pins:16 Operating Temperature Range:-40°C to +125°C Base Number:74 Clock Frequency Max:43MHz Count Max:16 Counter Measuring Functions:Presettable Synchronous Binary Up / Down Counter Device Marking:74HCT193 IC Generic Number:74HCT193 Logic Function Number:193 Logic IC Base Number:74193 Logic IC Family:HCT Logic IC Function:Presettable Synchronous 4bit Binary Up/Down Counter No. of Gates:1 No. of Inputs:4 Operating Temperature Max:125°C Operating Temperature Min:-40°C Package / Case:DIP Supply Voltage:5V Supply Voltage Max:5.5V Supply Voltage Min:4.5V Termination Type:Through Hole
IC9 = 74xx-eu:74*00: Quad 2-input NAND gate
IC10 IC11 = alexios:74*166: 8-bit parallel load SHIFT REGISTER
IC12 = alexios:SPEAKJET: SpeakJet serial-port-drive speech/effects synthesiser Web site: www.speakjet.com Datasheet: here <http://www.magnevation.com/pdfs/speakjetusermanual.pdf>
IC15 = 74xx-eu:74*04: Hex INVERTER
IC16 = alexios:AY-3-891*
IC17 = 74xx-eu:74*74: Dual D type positive edge triggered FLIP FLOP, preset and clear
IC18 IC19 = linear:LM386?-*: Low Voltage Audio Power Amplifier Source: http://cache.national.com/ds/LM/LM386.pdf
JP1 = jumper:JP2E: JUMPER
Q1 = special:XTAL/S: CRYSTAL
R1-R6 = resistor:R-EU_: RESISTOR, European symbol
R7 = pot:TRIM_EU-: POTENTIOMETER
R8-R13 R15-R20 = rcl:R-EU_: RESISTOR, European symbol
R14 = pot:3RP/1610G: 16mm Potentiometer two level Source: http://www.alphapotentiometers.net/html/16mm_pot_2.html
SV1 = con-lstb:MA09-2: PIN HEADER; OC_FARNELL: unknown; OC_NEWARK: unknown
SV2 = con-lstb:MA05-1: PIN HEADER; OC_FARNELL: unknown; OC_NEWARK: unknown
SV3 = con-lstb:MA10-2: PIN HEADER; OC_FARNELL: unknown; OC_NEWARK: unknown
SV4 = con-lstb:MA03-1: PIN HEADER; OC_FARNELL: unknown; OC_NEWARK: unknown
T1 = transistor-small-signal:BC557: PNP TRANSISTOR
X1 = con-lumberg:1503_09: Jack connectors according to JISC 6560, 3.5 mm Klinkeneinbaukupplung nach JISC 6560, 3,5 mm, 3-polig/ stereo, abgewinkelte Ausführung, mit 2 Öffnern und Lötaugen, für Leiterplatten Rückseitenmontage Source: http://www.lumberg.com/Produkte/PDFs/1503_09.pdf; OC_FARNELL: 1243244; OC_NEWARK: unknown

## Net classes
0 default: width 0.305 mm, clearance 0.203 mm
1 low power: width 0.61 mm, clearance 0.254 mm
2 LED power: width 1.93 mm, clearance 0.254 mm

## Board
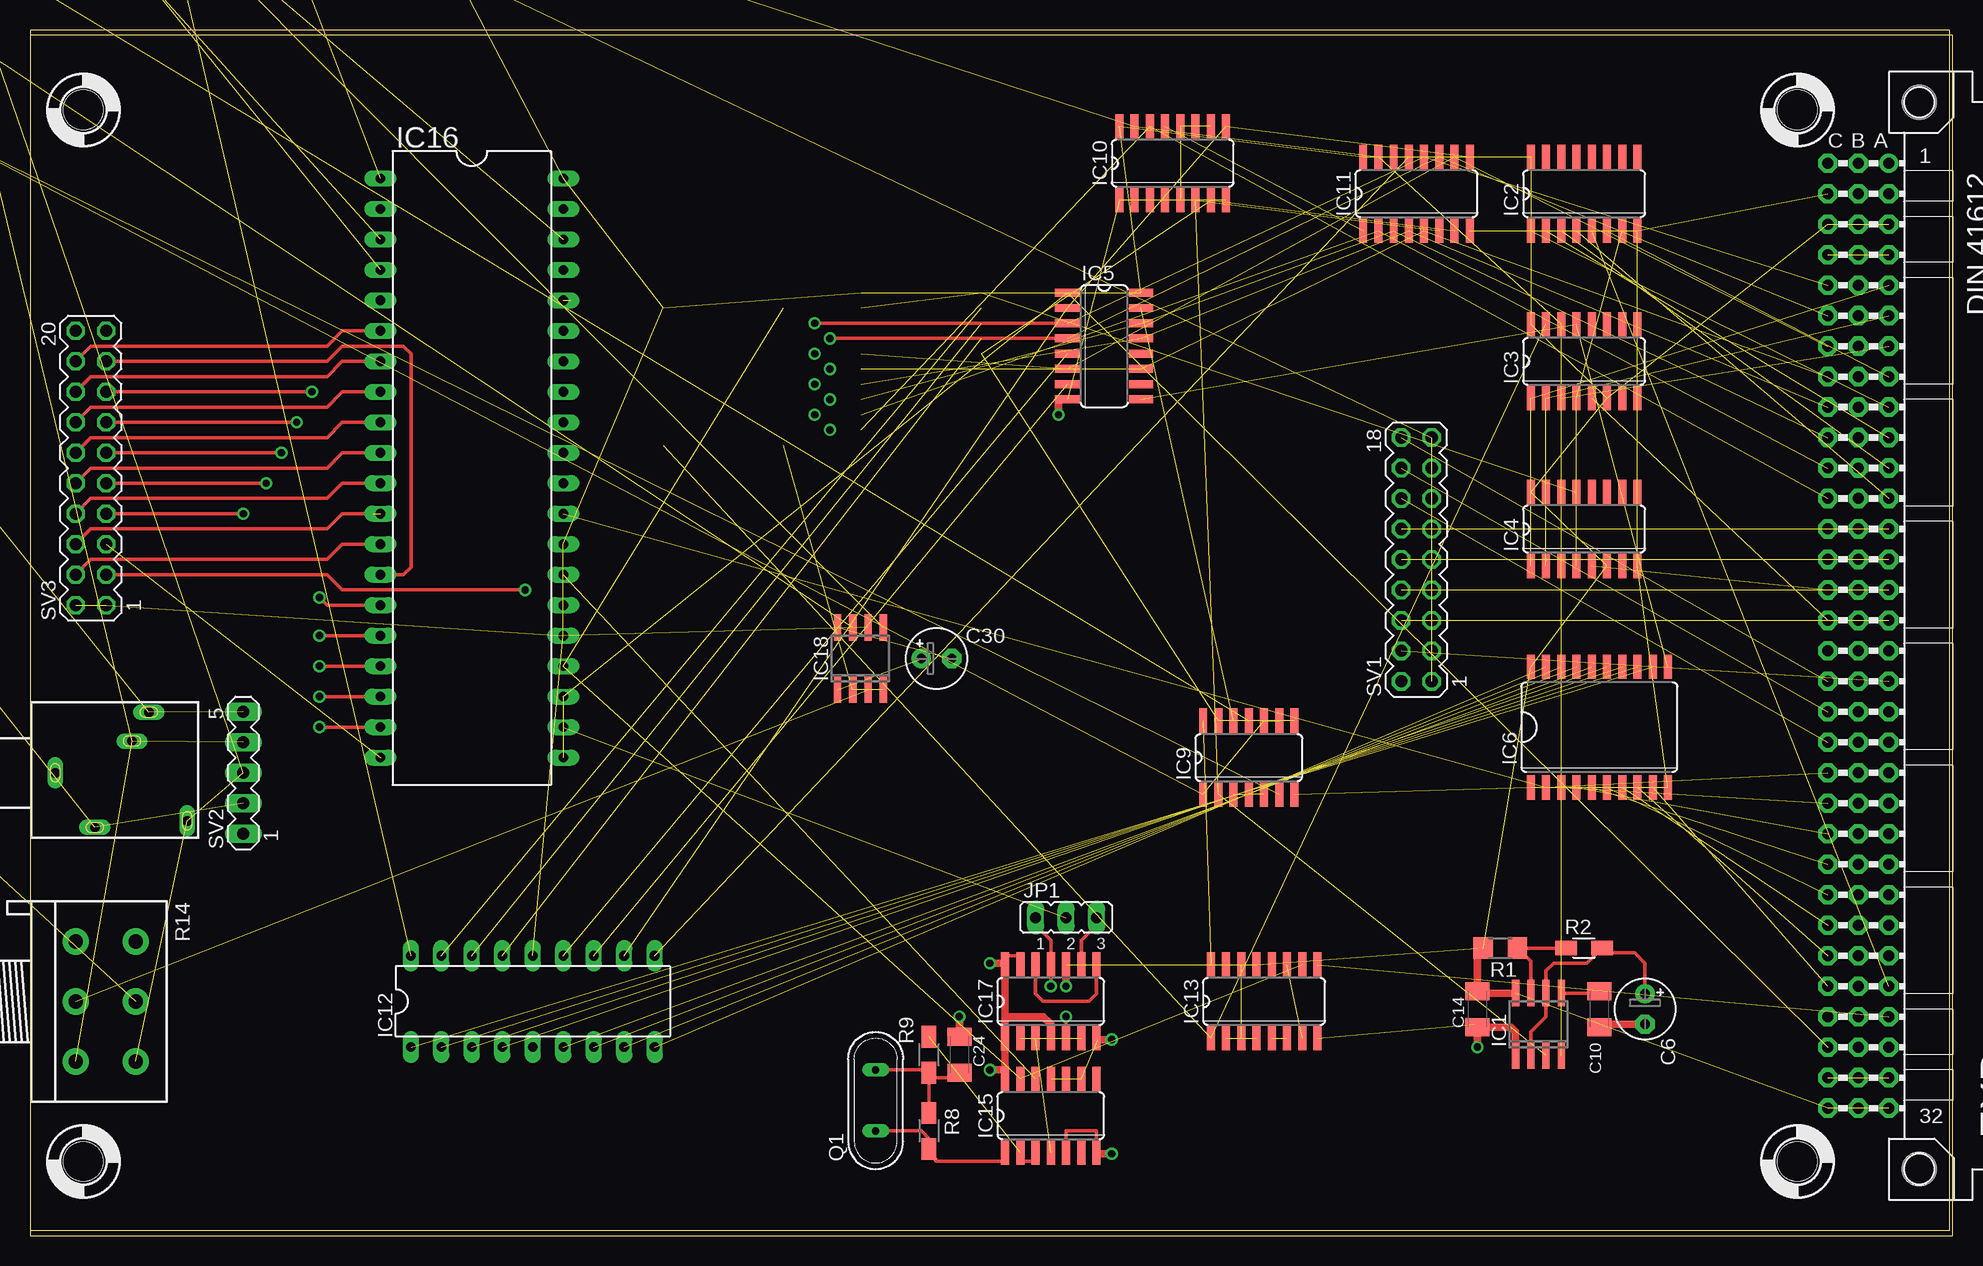
[diagram p4: board, top side]
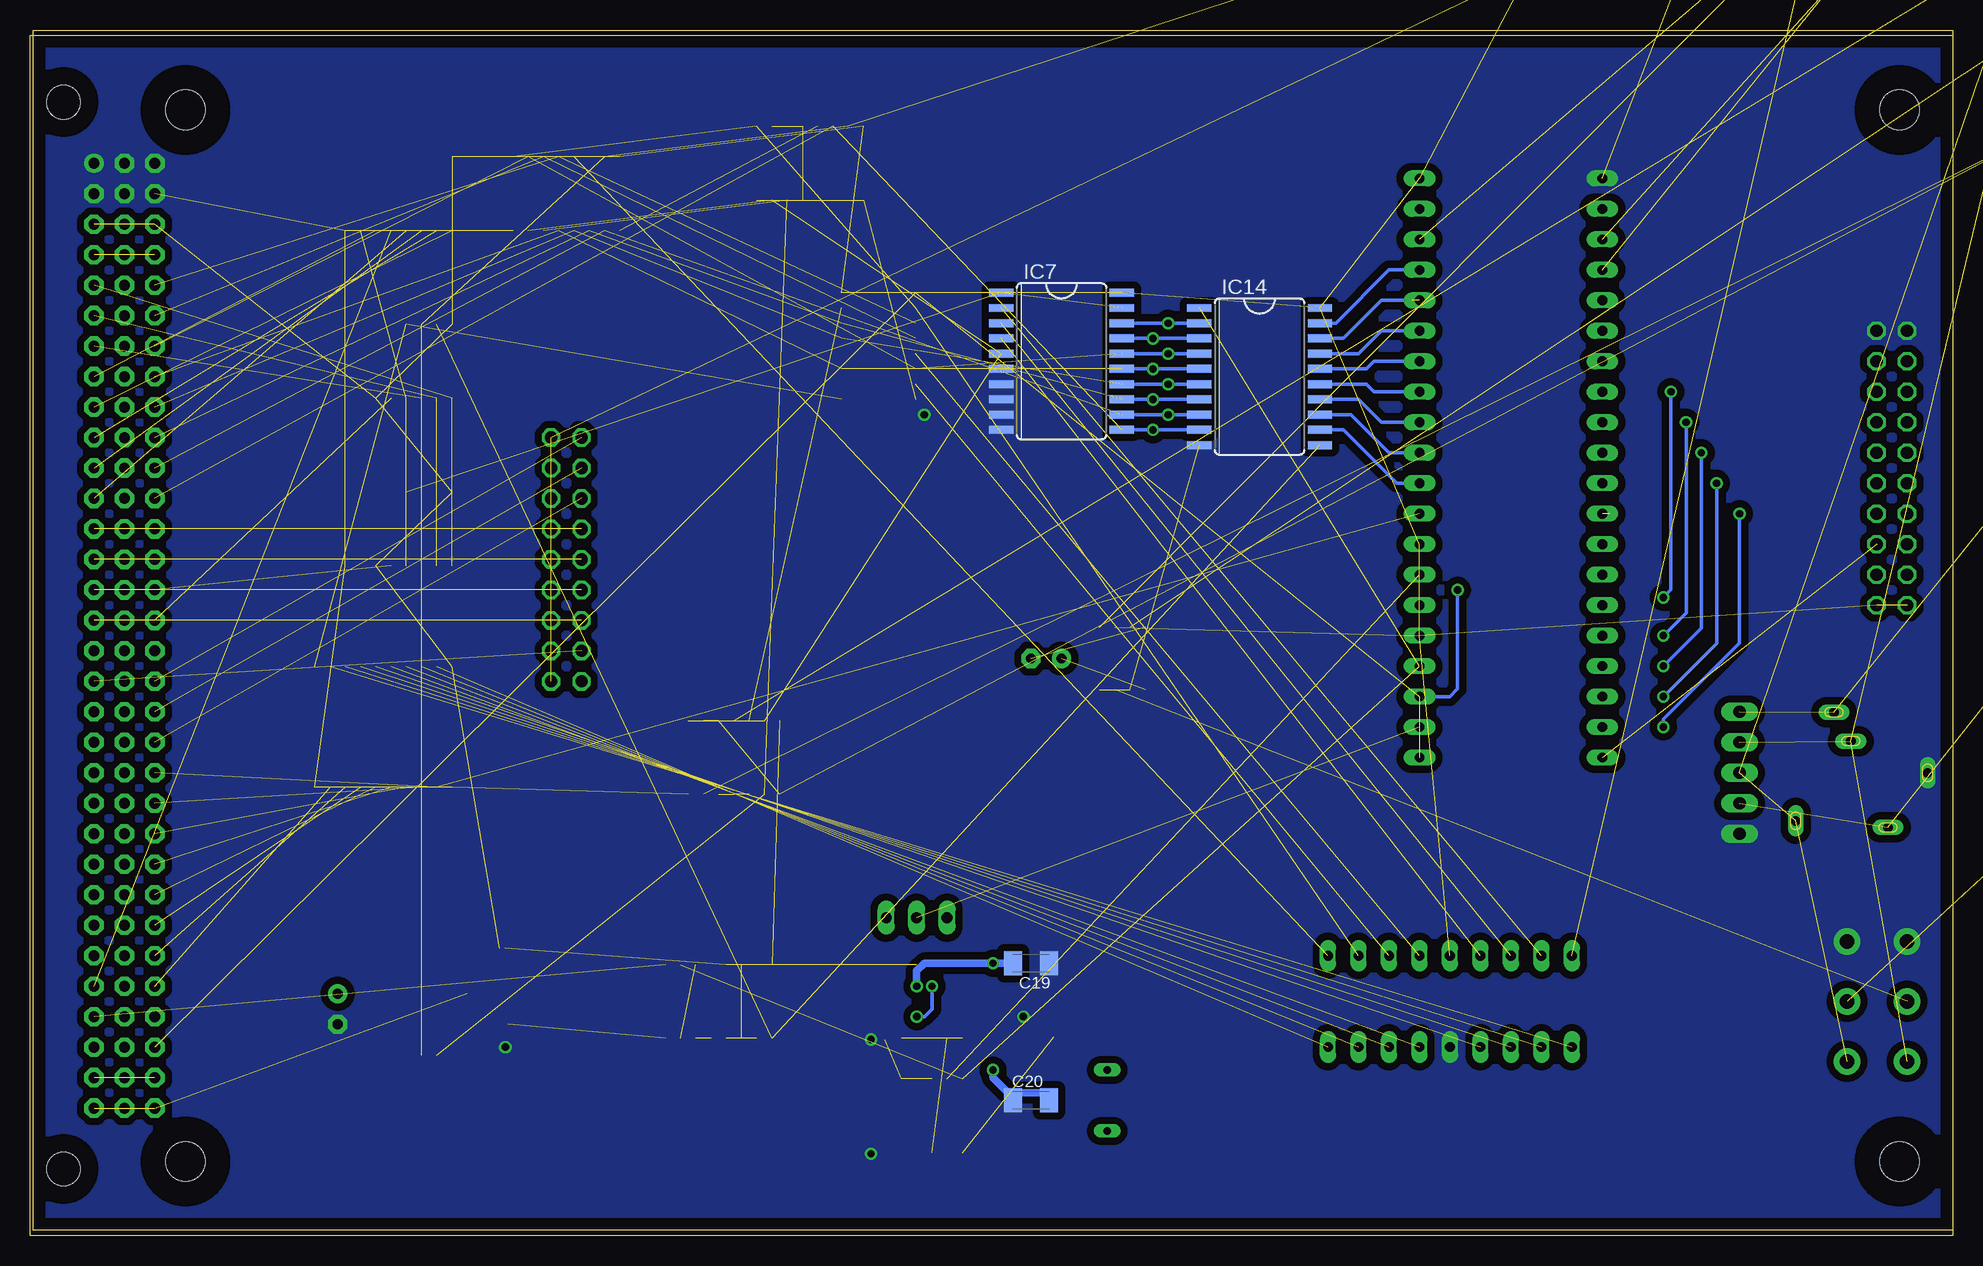
[diagram p5: board, bottom side, seen from below]

Size 160 x 100 mm. Coordinates in mm from the lower left corner, seen from the top.
Outline: 0,0 160,0 160,100 0,100 0,0
Copper layers (1*16): Top 0.035mm / dielectric 1.5mm / Bottom 0.035mm
Design rules "default": minimum track width 10mil, minimum drill 24mil, track to track 8mil, track to pad 8mil, pad to pad 8mil, via to via 8mil, smd to smd 8mil, copper to edge 40mil, drill to drill 8mil, minimum pad ring 10mil, minimum via ring 8mil, stop-mask expansion 4mil, vias tented up to drill 0mil, thermal gap 10mil

### Footprints (pad centres in the part's own frame; a part is rotated, then mirrored left to right if it is on the bottom)
C1206K = smd 1.5 x 2: 1 -1.5,0; 2 1.5,0
E2,5-5 = drill 0.813 pad 1.6 round: + -1.27,0 | drill 0.813 pad 1.6 octagon: - 1.27,0
C025-024X044 = drill 0.813 octagon: 1 -1.27,0; 2 1.27,0
SMC_D = smd 2.4 x 2.8: + -3.15,0; - 3.15,0
VG96K = drill 0.914 pad 1.6 round: A1 154.94,39.37 | drill 0.914 pad 1.6 octagon: A2 154.94,36.83; A3 154.94,34.29; A4 154.94,31.75; A5 154.94,29.21; A6 154.94,26.67; A7 154.94,24.13; A8 154.94,21.59; A9 154.94,19.05; A10 154.94,16.51; A11 154.94,13.97; A12 154.94,11.43; A13 154.94,8.89; A14 154.94,6.35; A15 154.94,3.81; A16 154.94,1.27; A17 154.94,-1.27; A18 154.94,-3.81; A19 154.94,-6.35; A20 154.94,-8.89; A21 154.94,-11.43; A22 154.94,-13.97; A23 154.94,-16.51; A24 154.94,-19.05; A25 154.94,-21.59; A26 154.94,-24.13; A27 154.94,-26.67; A28 154.94,-29.21; A29 154.94,-31.75; A30 154.94,-34.29; A31 154.94,-36.83; A32 154.94,-39.37; B1 152.4,39.37; B2 152.4,36.83; B3 152.4,34.29; B4 152.4,31.75; B5 152.4,29.21; B6 152.4,26.67; B7 152.4,24.13; B8 152.4,21.59; B9 152.4,19.05; B10 152.4,16.51; B11 152.4,13.97; B12 152.4,11.43; B13 152.4,8.89; B14 152.4,6.35; B15 152.4,3.81; B16 152.4,1.27; B17 152.4,-1.27; B18 152.4,-3.81; B19 152.4,-6.35; B20 152.4,-8.89; B21 152.4,-11.43; B22 152.4,-13.97; B23 152.4,-16.51; B24 152.4,-19.05; B25 152.4,-21.59; B26 152.4,-24.13; B27 152.4,-26.67; B28 152.4,-29.21; B29 152.4,-31.75; B30 152.4,-34.29; B31 152.4,-36.83; B32 152.4,-39.37; C1 149.86,39.37; C2 149.86,36.83; C3 149.86,34.29; C4 149.86,31.75; C5 149.86,29.21; C6 149.86,26.67; C7 149.86,24.13; C8 149.86,21.59; C9 149.86,19.05; C10 149.86,16.51; C11 149.86,13.97; C12 149.86,11.43; C13 149.86,8.89; C14 149.86,6.35; C15 149.86,3.81; C16 149.86,1.27; C17 149.86,-1.27; C18 149.86,-3.81; C19 149.86,-6.35; C20 149.86,-8.89; C21 149.86,-11.43; C22 149.86,-13.97; C23 149.86,-16.51; C24 149.86,-19.05; C25 149.86,-21.59; C26 149.86,-24.13; C27 149.86,-26.67; C28 149.86,-29.21; C29 149.86,-31.75; C30 149.86,-34.29; C31 149.86,-36.83; C32 149.86,-39.37 | hole 2.794: 157.48,44.45; 157.48,-44.45
STANDOFF_28_60 = hole 3.302: 0,0
SO08 = smd 0.6 x 2.2: 1 -1.905,-2.6; 2 -0.635,-2.6; 3 0.635,-2.6; 4 1.905,-2.6; 5 1.905,2.6; 6 0.635,2.6; 7 -0.635,2.6; 8 -1.905,2.6
SO16 = smd 0.66 x 2.032: 1 -4.445,-3.073; 2 -3.175,-3.073; 3 -1.905,-3.073; 4 -0.635,-3.073; 5 0.635,-3.073; 6 1.905,-3.073; 7 3.175,-3.073; 8 4.445,-3.073; 9 4.445,3.073; 10 3.175,3.073; 11 1.905,3.073; 12 0.635,3.073; 13 -0.635,3.073; 14 -1.905,3.073; 15 -3.175,3.073; 16 -4.445,3.073
SO20W = smd 0.66 x 2.032: 1 -5.715,-5.029; 2 -4.445,-5.029; 3 -3.175,-5.029; 4 -1.905,-5.029; 5 -0.635,-5.029; 6 0.635,-5.029; 7 1.905,-5.029; 8 3.175,-5.029; 9 4.445,-5.029; 10 5.715,-5.029; 11 5.715,5.029; 12 4.445,5.029; 13 3.175,5.029; 14 1.905,5.029; 15 0.635,5.029; 16 -0.635,5.029; 17 -1.905,5.029; 18 -3.175,5.029; 19 -4.445,5.029; 20 -5.715,5.029
SO16D = smd 0.6 x 1.4: 1 -4.445,-2.715; 2 -3.175,-2.715; 3 -1.905,-2.715; 4 -0.635,-2.715; 5 0.635,-2.715; 6 1.905,-2.715; 7 3.175,-2.715; 8 4.445,-2.715; 9 4.445,2.715; 10 3.175,2.715; 11 1.905,2.715; 12 0.635,2.715; 13 -0.635,2.715; 14 -1.905,2.715; 15 -3.175,2.715; 16 -4.445,2.715
SO14 = smd 0.66 x 2.032: 1 -3.81,-3.073; 2 -2.54,-3.073; 3 -1.27,-3.073; 4 0,-3.073; 5 1.27,-3.073; 6 2.54,-3.073; 7 3.81,-3.073; 8 3.81,3.073; 9 2.54,3.073; 10 1.27,3.073; 11 0,3.073; 12 -1.27,3.073; 13 -2.54,3.073; 14 -3.81,3.073
DIL18 = drill 0.813 long: 1 -10.16,-3.81; 2 -7.62,-3.81; 3 -5.08,-3.81; 4 -2.54,-3.81; 5 0,-3.81; 6 2.54,-3.81; 7 5.08,-3.81; 8 7.62,-3.81; 9 10.16,-3.81; 10 10.16,3.81; 11 7.62,3.81; 12 5.08,3.81; 13 2.54,3.81; 14 0,3.81; 15 -2.54,3.81; 16 -5.08,3.81; 17 -7.62,3.81; 18 -10.16,3.81
DIL40 = drill 0.813 long: 1 -24.13,-7.62; 2 -21.59,-7.62; 3 -19.05,-7.62; 4 -16.51,-7.62; 5 -13.97,-7.62; 6 -11.43,-7.62; 7 -8.89,-7.62; 8 -6.35,-7.62; 9 -3.81,-7.62; 10 -1.27,-7.62; 11 1.27,-7.62; 12 3.81,-7.62; 13 6.35,-7.62; 14 8.89,-7.62; 15 11.43,-7.62; 16 13.97,-7.62; 17 16.51,-7.62; 18 19.05,-7.62; 19 21.59,-7.62; 20 24.13,-7.62; 21 24.13,7.62; 22 21.59,7.62; 23 19.05,7.62; 24 16.51,7.62; 25 13.97,7.62; 26 11.43,7.62; 27 8.89,7.62; 28 6.35,7.62; 29 3.81,7.62; 30 1.27,7.62; 31 -1.27,7.62; 32 -3.81,7.62; 33 -6.35,7.62; 34 -8.89,7.62; 35 -11.43,7.62; 36 -13.97,7.62; 37 -16.51,7.62; 38 -19.05,7.62; 39 -21.59,7.62; 40 -24.13,7.62
JP2 = drill 0.914 long: 1 -2.54,0; 2 0,0; 3 2.54,0
QS = drill 0.61 long: 1 -2.54,0; 2 2.54,0
R1206 = smd 1.6 x 1.803: 1 -1.422,0; 2 1.422,0
R1206W = smd 1.8 x 1.2: 1 -1.499,0; 2 1.499,0
0204/7 = drill 0.813 octagon: 1 -3.81,0; 2 3.81,0
CT6 = drill 0.813 octagon: A 2.515,0; E -2.515,0; S 0,-2.54
3RP/1610G = drill 1.2 pad 2.184 round: 1-1 -5,0; 1-2 0,0; 1-3 5,0; 2-1 -5,5; 2-2 0,5; 2-3 5,5
MA09-2 = drill 1.016 octagon: 1 -10.16,-1.27; 2 -10.16,1.27; 3 -7.62,-1.27; 4 -7.62,1.27; 5 -5.08,-1.27; 6 -5.08,1.27; 7 -2.54,-1.27; 8 -2.54,1.27; 9 0,-1.27; 10 0,1.27; 11 2.54,-1.27; 12 2.54,1.27; 13 5.08,-1.27; 14 5.08,1.27; 15 7.62,-1.27; 16 7.62,1.27; 17 10.16,-1.27; 18 10.16,1.27
MA05-1 = drill 1.016 long: 1 -5.08,0; 2 -2.54,0; 3 0,0; 4 2.54,0; 5 5.08,0
MA10-2 = drill 1.016 octagon: 1 -11.43,-1.27; 2 -11.43,1.27; 3 -8.89,-1.27; 4 -8.89,1.27; 5 -6.35,-1.27; 6 -6.35,1.27; 7 -3.81,-1.27; 8 -3.81,1.27; 9 -1.27,-1.27; 10 -1.27,1.27; 11 1.27,-1.27; 12 1.27,1.27; 13 3.81,-1.27; 14 3.81,1.27; 15 6.35,-1.27; 16 6.35,1.27; 17 8.89,-1.27; 18 8.89,1.27; 19 11.43,-1.27; 20 11.43,1.27
MA03-1 = drill 1.016 long: 1 -2.54,0; 2 0,0; 3 2.54,0
SOT54A = drill 0.813 octagon: B 0,1.905; C -1.27,0; E 1.27,0
1503_09 = drill 0.8 pad 1.2 long: 1 0,-2.1; 2 -4.55,-5.4; 3 5.05,-9.9; 4 -4,-13.1; 5 2.65,-8.5

### Placement (x,y rotation side)
C1  -213.36,-21.59 0 top  (outside the outline)
C2  -208.28,-21.59 0 top  (outside the outline)
C3  -213.36,-27.94 0 top  (outside the outline)
C4  -208.28,-27.94 0 top  (outside the outline)
C5  -213.36,-34.29 0 top  (outside the outline)
C6  134.62,18.41 270 top
C7  -208.28,-34.29 0 top  (outside the outline)
C8  -213.36,-40.64 0 top  (outside the outline)
C9  -208.28,-40.64 0 top  (outside the outline)
C10  130.81,18.41 90 top
C11  -218.44,-40.64 0 top  (outside the outline)
C12  -223.52,-40.64 0 top  (outside the outline)
C13  -73.66,207.01 0 top  (outside the outline)
C14  120.65,18.41 90 top
C15  -228.6,-40.64 0 top  (outside the outline)
C16  -60.96,207.01 0 top  (outside the outline)
C17  -67.31,207.01 0 top  (outside the outline)
C18  -30.48,213.36 0 top  (outside the outline)
C19  76.83,22.23 180 bottom
C20  76.83,10.79 0 bottom
C21  -208.28,-15.24 0 top  (outside the outline)
C22  -213.36,-15.24 0 top  (outside the outline)
C24  77.47,14.61 270 top
C25  -140.97,196.85 0 top  (outside the outline)
C26  -163.83,205.74 0 top  (outside the outline)
C27  -173.99,205.74 0 top  (outside the outline)
C28  -147.32,196.85 0 top  (outside the outline)
C29  -153.67,196.85 0 top  (outside the outline)
C30  75.56,47.62 0 top
C31  -86.36,207.01 0 top  (outside the outline)
C32  -142.24,205.74 0 top  (outside the outline)
C33  -160.02,196.85 0 top  (outside the outline)
C34  -166.37,196.85 0 top  (outside the outline)
C35  -194.31,205.74 0 top  (outside the outline)
C36  -92.71,207.01 0 top  (outside the outline)
C37  -153.67,205.74 0 top  (outside the outline)
C38  -20.32,213.36 0 top  (outside the outline)
EXP  0,49.53 0 top
H1  4.45,93.34 0 top
H2  147.32,93.34 0 top
H3  147.32,5.71 0 top
H4  4.45,5.71 0 top
IC1  125.73,17.14 0 top
IC2  129.54,86.36 0 top
IC3  129.54,72.39 0 top
IC4  129.54,58.42 0 top
IC5  89.53,73.66 270 top
IC6  130.81,41.91 0 top
IC7  74.3,72.39 270 bottom
IC8  -168.91,173.99 0 top  (outside the outline)
IC9  101.6,39.37 0 top
IC10  95.25,88.9 0 top
IC11  115.57,86.36 0 top
IC12  41.91,19.05 0 top
IC13  102.87,19.05 0 top
IC14  57.78,71.12 270 bottom
IC15  85.09,9.53 0 top
IC16  36.83,63.5 270 top
IC17  85.09,19.05 0 top
IC18  69.22,47.62 0 top
IC19  -170.18,185.42 0 top  (outside the outline)
JP1  86.36,26.04 0 top
Q1  70.48,10.79 90 top
R1  122.56,23.5 180 top
R2  129.54,23.5 0 top
R3  -182.88,212.09 0 top  (outside the outline)
R4  -193.04,212.09 0 top  (outside the outline)
R5  -17.78,218.44 0 top  (outside the outline)
R6  -27.94,218.44 0 top  (outside the outline)
R7  -147.32,186.69 0 top  (outside the outline)
R8  74.93,8.26 270 top
R9  74.93,14.61 90 top
R10  -81.28,212.09 0 top  (outside the outline)
R11  -91.44,212.09 0 top  (outside the outline)
R12  -101.6,212.09 0 top  (outside the outline)
R13  -111.76,212.09 0 top  (outside the outline)
R14  3.81,19.05 270 top
R15  -121.92,212.09 0 top  (outside the outline)
R16  -132.08,212.09 0 top  (outside the outline)
R17  -142.24,212.09 0 top  (outside the outline)
R18  -38.1,218.44 0 top  (outside the outline)
R19  -48.26,218.44 0 top  (outside the outline)
R20  -152.4,212.09 0 top  (outside the outline)
SV1  115.57,55.88 90 top
SV2  17.78,38.1 90 top
SV3  5.08,63.5 90 top
SV4  -38.1,213.36 0 top  (outside the outline)
T1  -53.34,213.36 0 top  (outside the outline)
X1  0,38.1 90 top

### Tracks (layer width: path | path; a pad name or v marks a point on that pad's centre or on a via)
1MHZ
  Top 0.305: JP1.3 88.9,25.4 87.63,24.13 IC17.9
2MHZ  (via drill 0.61)
  Top 0.305: JP1.1 83.82,25.4 85.09,24.13 IC17.11 v85.09,20.32 | IC17.5 v86.36,17.78
  Bottom 0.305: v86.36,17.78 85.72,17.78 85.09,18.41 v85.09,20.32
!INTRN2  (9 unrouted)
!IRQ0  (1 unrouted)
!IRQ1  (1 unrouted)
!IRQ2  (1 unrouted)
!IRQ3  (1 unrouted)
!IRQ4  (1 unrouted)
!IRQ5  (1 unrouted)
!IRQ6  (1 unrouted)
!IRQ7  (1 unrouted)
!PSGCS  (3 unrouted)
!PSGW  (2 unrouted)
!R  (1 unrouted)
!RESET  (2 unrouted)
!SJCE  (4 unrouted)
!SJCRR  (2 unrouted)
!SJCRW  (2 unrouted)
!SJRST  (3 unrouted)
!SJW  (4 unrouted)
!SNDCS  (2 unrouted)
!SYSDEV  (1 unrouted)
!W  (1 unrouted)
+3.3V  (2 unrouted)
+12V  (2 unrouted)
AB0  (2 unrouted)
AB1  (2 unrouted)
AB2  (2 unrouted)
AB3  (1 unrouted)
AB4  (1 unrouted)
AB5  (1 unrouted)
AB6  (1 unrouted)
AB7  (1 unrouted)
CLK1  (1 unrouted)
DB0  (via drill 0.61)  (2 unrouted)
  Top 0.305: v65.41,75.56 IC5.3
  Bottom 0.305: IC14.2 v65.41,75.56 IC7.18
DB1  (via drill 0.61)  (2 unrouted)
  Top 0.305: v66.67,74.3 IC5.4
  Bottom 0.305: IC14.3 v66.67,74.3 IC7.17
DB2  (via drill 0.61)  (3 unrouted)
  Bottom 0.305: IC14.4 v65.41,73.03 IC7.16
DB3  (via drill 0.61)  (3 unrouted)
  Bottom 0.305: IC14.5 v66.67,71.75 IC7.15
DB4  (via drill 0.61)  (3 unrouted)
  Bottom 0.305: IC14.6 v65.41,70.48 IC7.14
DB5  (via drill 0.61)  (3 unrouted)
  Bottom 0.305: IC14.7 v66.67,69.22 IC7.13
DB6  (via drill 0.61)  (2 unrouted)
  Bottom 0.305: IC14.8 v65.41,67.94 IC7.12
DB7  (via drill 0.61)  (2 unrouted)
  Bottom 0.305: IC14.9 v66.67,66.67 IC7.11
DB8  (2 unrouted)
DB9  (1 unrouted)
DB10  (1 unrouted)
DB11  (1 unrouted)
DB12  (1 unrouted)
DB13  (1 unrouted)
DB14  (1 unrouted)
DB15  (1 unrouted)
GND  (via drill 0.61)  (47 unrouted)
  Top 0.305: IC15.5 86.36,8.26 88.9,8.26 IC15.7
  Top 0.61: C14.1 120.42,17.14 | C14.1 123.42,16.91 123.83,16.51 IC1.1 | C14.1 v120.65,15.24 | C6.- 131.04,17.14 C10.1 | IC15.7 89,6.35 v90.17,6.35 | IC17.7 89,15.88 v90.17,15.88 | C24.1 v77.47,17.78 | IC5.8 85.72,69.22 v85.72,67.94
  pour Bottom (isolate 0.61, no thermals): 0,100.33 160.02,100.33 160.02,0 0,0
L-SPK  (1 unrouted)
LEFT  (3 unrouted)
LEFT-IN  (3 unrouted)
N$29  (1 unrouted)
N$30  (2 unrouted)
N$35  (2 unrouted)
N$37  (1 unrouted)
N$46  (2 unrouted)
N$47  (1 unrouted)
N$48  (1 unrouted)
N$49  (1 unrouted)
N$50  (1 unrouted)
N$80  (1 unrouted)
N$81
  Bottom 0.305: IC16.30 46.35,62.23 50.8,66.67 IC14.12
N$84
  Bottom 0.305: IC16.31 46.99,64.77 50.16,67.94 IC14.13
N$85  (1 unrouted)
N$86  (2 unrouted)
N$87  (1 unrouted)
N$88  (1 unrouted)
N$92  (2 unrouted)
N$146  (1 unrouted)
N$148  (1 unrouted)
N$149  (1 unrouted)
N$361
  Top 0.305: IC15.1 81.28,5.71 75.56,5.71 R8.2 74.93,7.62 74.3,8.26 Q1.1
N$362  (1 unrouted)
  Top 0.305: IC15.2 82.55,5.71 83.82,5.71 IC15.3
N$363
  Top 0.305: R8.1 74.93,12.7 | R9.1 | Q1.2 74.93,13.34 R9.1 | C24.2 arc-90 77.06,12.7 74.93,12.7 | 74.93,12.7 R9.1
N$364  (1 unrouted)
N$365
  Bottom 0.305: IC16.32 47.62,67.31 49.53,69.22 IC14.14
N$367  (1 unrouted)
N$368
  Top 0.305: IC17.12 83.82,19.68 84.45,19.05 88.27,19.05 88.9,19.68 IC17.8
N$374
  Bottom 0.305: IC16.33 48.26,69.85 48.9,70.48 IC14.15
N$380
  Bottom 0.305: IC16.34 48.26,72.39 48.9,71.75 IC14.16
N$383
  Bottom 0.305: IC14.17 49.53,73.03 47.62,74.93 IC16.35
N$384  (1 unrouted)
  Bottom 0.305: IC14.18 50.8,74.3 47.62,77.47 45.09,77.47
N$386
  Bottom 0.305: IC14.19 51.44,75.56 46.99,80.01 IC16.37
N$387  (1 unrouted)
N$388  (1 unrouted)
N$419  (1 unrouted)
N$420  (1 unrouted)
N$421  (1 unrouted)
N$422  (1 unrouted)
N$423
  Top 0.305: IC1.5 130.64,19.75 C10.2
N$424
  Top 0.305: IC1.2 125.09,16.51 126.36,17.78 IC1.6 126.36,21.59 127,22.23 129.77,22.23 R2.2 131.44,23.09 133.76,23.09 134.62,22.23 C6.+
N$425  (1 unrouted)
N$442
  Top 0.305: IC1.7 125.09,22.38 R1.1 R2.1
N$443  (1 unrouted)
N$444  (2 unrouted)
N$445  (3 unrouted)
N$446  (2 unrouted)
N$447  (2 unrouted)
N$448  (1 unrouted)
PSGCLK  (1 unrouted)
PSGO0  (via drill 0.61)  (1 unrouted)
  Top 0.305: SV3.3 24.77,54.61 26.04,53.34 v41.27,53.34
  Bottom 0.305: v41.27,53.34 41.27,45.09 41.91,44.45 44.45,44.45
PSGO1  (1 unrouted)
PSGO2  (via drill 0.61)
  Top 0.305: v24.13,41.91 IC16.19 | SV3.7 v17.78,59.69
  Bottom 0.305: v24.13,41.91 24.13,42.55 17.78,48.9 v17.78,59.69
PSGO3  (via drill 0.61)
  Top 0.305: SV3.9 v19.68,62.23 | v24.13,44.45 IC16.18
  Bottom 0.305: v19.68,62.23 19.68,48.9 v24.13,44.45
PSGO4  (via drill 0.61)
  Top 0.305: SV3.11 v20.95,64.77 | v24.13,46.99 IC16.17
  Bottom 0.305: v20.95,64.77 20.95,50.16 v24.13,46.99
PSGO5  (via drill 0.61)
  Top 0.305: SV3.13 v22.23,67.31 | v24.13,49.53 IC16.16
  Bottom 0.305: v22.23,67.31 22.23,51.44 v24.13,49.53
PSGO6  (via drill 0.61)
  Top 0.305: SV3.15 v23.5,69.85 | v24.13,52.7 24.77,52.07 IC16.15
  Bottom 0.305: v23.5,69.85 23.5,53.34 v24.13,52.7
PSGO7
  Top 0.305: SV3.17 24.77,72.39 26.04,73.66 31.11,73.66 31.75,73.03 31.75,55.24 31.11,54.61 IC16.14
PSGO8
  Top 0.305: IC16.13 26.04,57.15 24.77,55.88 5.08,55.88 SV3.4
PSGO9  (1 unrouted)
  Top 0.305: SV3.6 5.08,58.42 24.77,58.42 26.04,59.69 28.57,59.69
PSGO10
  Top 0.305: IC16.11 26.04,62.23 24.77,60.96 5.08,60.96 SV3.8
PSGO11
  Top 0.305: IC16.10 26.04,64.77 24.77,63.5 5.08,63.5 SV3.10
PSGO12
  Top 0.305: SV3.12 5.08,66.04 24.77,66.04 26.04,67.31 IC16.9
PSGO13
  Top 0.305: IC16.8 26.04,69.85 24.77,68.58 5.08,68.58 SV3.14
PSGO14
  Top 0.305: SV3.16 5.08,71.12 24.77,71.12 26.04,72.39 IC16.7
PSGO15
  Top 0.305: SV3.18 5.08,73.66 24.77,73.66 26.04,74.93 IC16.6
PSGW  (1 unrouted)
R-SPK  (1 unrouted)
RIGHT  (3 unrouted)
RIGHT-IN  (3 unrouted)
SJAUDIO  (2 unrouted)
SJBHF  (1 unrouted)
SJCLK  (3 unrouted)
SJDATA  (1 unrouted)
SJE0  (1 unrouted)
SJE1  (1 unrouted)
SJE2  (1 unrouted)
SJE3  (1 unrouted)
SJE4  (1 unrouted)
SJE5  (1 unrouted)
SJE6  (1 unrouted)
SJE7  (1 unrouted)
SJIRQEN  (1 unrouted)
SJM0  (1 unrouted)
SJM1  (1 unrouted)
SJRDY  (1 unrouted)
SJSPK  (1 unrouted)
VCC  (via drill 0.61)  (47 unrouted)
  Top 0.305: IC1.8 123.83,19.91 | IC17.14 81.28,22.86 82.55,22.86 IC17.13
  Top 0.61: R1.2 120.65,23.5 C14.2 120.65,19.75 IC1.8 | v80.01,22.23 81.18,22.23 IC17.14 81.28,17.78 | v86.36,20.32 IC17.10 | 81.28,13.34 IC15.14 | v80.01,13.34 81.28,13.34 | 81.28,13.34 IC17.1 81.28,17.78 | 81.28,17.78 84.45,17.78 85.09,17.14 IC17.4
  Bottom 0.61: v86.36,20.32 86.36,21.59 85.72,22.23 v80.01,22.23 C19.2 | C20.2 75.33,11.43 78.74,11.43 80.01,12.7 v80.01,13.34